# Altium project Zynq7000 SOM.PrjPcb (part 1 of 2)
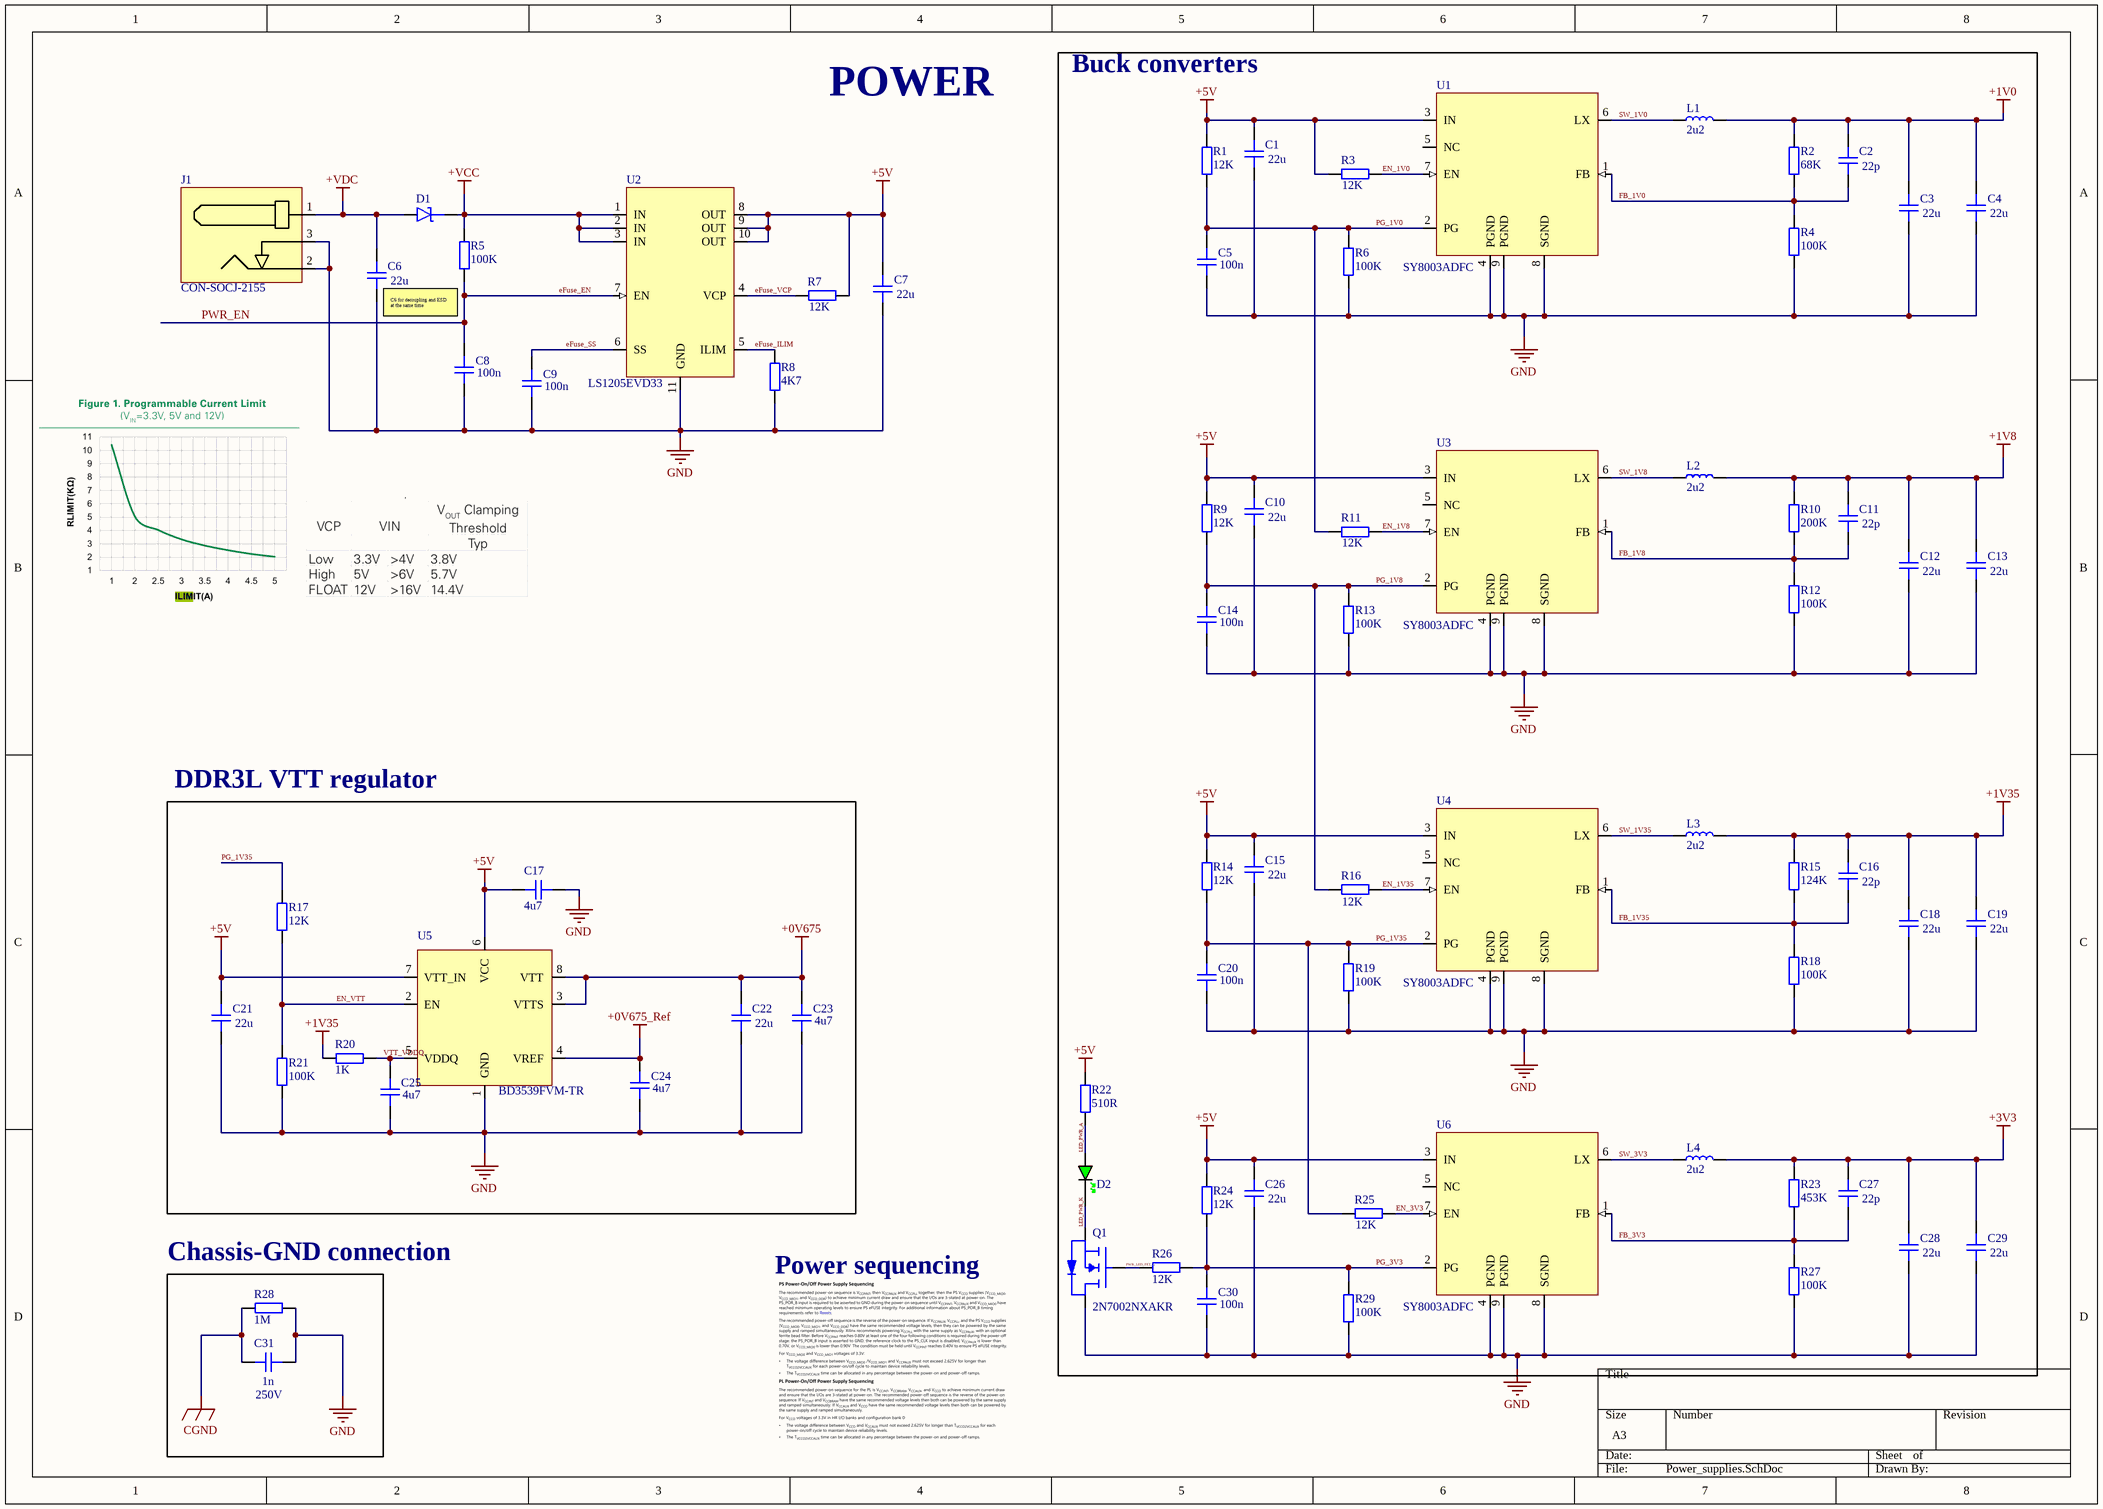
[diagram p0: Power_supplies.SchDoc]
10 sheets, 425 parts. Net scope: global (net labels, ports and power ports of the same name join across sheets).
Board file: Zettbret.PcbDoc
Sheets:
  Power_supplies.SchDoc
  Zynq power and decoupling.SchDoc
  Zynq config, JTAG, Debug.SchDoc
  Zynq processing system (PS).SchDoc
  Zynq programmable logic (PL).SchDoc
  Zynq DDR Interface & Termination.SchDoc
  1GB DDR3L Modules.SchDoc
  Gigabit Ethernet.SchDoc
  USB 2.0 High-Speed (OTG).SchDoc
  Mezzanine Connectors.SchDoc

## Sheet Power_supplies.SchDoc
size A3; SheetNumber: 2; SheetTotal: 11

### Parts
C1  value 22u  [CAP_1210]  (hidden comment: C1210)
C2  value 22p  [CAP_0402]  (hidden comment: C0402)
C3  value 22u  [CAP_1210]  (hidden comment: C1210)
C4  value 22u  [CAP_1210]  (hidden comment: C1210)
C5  value 100n  [CAP_0402]  (hidden comment: C0402)
C6  value 22u  [CAP_1210]  (hidden comment: C1210)
C7  value 22u  [CAP_1210]  (hidden comment: C1210)
C8  value 100n  [CAP_0402]  (hidden comment: C0402)
C9  value 100n  [CAP_0402]  (hidden comment: C0402)
C10  value 22u  [CAP_1210]  (hidden comment: C1210)
C11  value 22p  [CAP_0402]  (hidden comment: C0402)
C12  value 22u  [CAP_1210]  (hidden comment: C1210)
C13  value 22u  [CAP_1210]  (hidden comment: C1210)
C14  value 100n  [CAP_0402]  (hidden comment: C0402)
C15  value 22u  [CAP_1210]  (hidden comment: C1210)
C16  value 22p  [CAP_0402]  (hidden comment: C0402)
C17  value 4u7  [CAP_0402]  (hidden comment: C0402)
C18  value 22u  [CAP_1210]  (hidden comment: C1210)
C19  value 22u  [CAP_1210]  (hidden comment: C1210)
C20  value 100n  [CAP_0402]  (hidden comment: C0402)
C21  value 22u  [CAP_1210]  (hidden comment: C1210)
C22  value 22u  [CAP_1210]  (hidden comment: C1210)
C23  value 4u7  [CAP_0402]  (hidden comment: C0402)
C24  value 4u7  [CAP_0402]  (hidden comment: C0402)
C25  value 4u7  [CAP_0402]  (hidden comment: C0402)
C26  value 22u  [CAP_1210]  (hidden comment: C1210)
C27  value 22p  [CAP_0402]  (hidden comment: C0402)
C28  value 22u  [CAP_1210]  (hidden comment: C1210)
C29  value 22u  [CAP_1210]  (hidden comment: C1210)
C30  value 100n  [CAP_0402]  (hidden comment: C0402)
C31  value 1n  Voltage: 250V  [CAP_1206]  (hidden comment: C1206)
D1  D_SCHOTTKY_SOD_323  [SOD-323]  (value not drawn)
D2  GREEN  [LED_0402_GREEN]  (value not drawn)
J1  CON-SOCJ-2155  [CON-SOCJ-2155]
L1  2u2  [SRP0415]
L2  2u2  [SRP0415]
L3  2u2  [SRP0415]
L4  2u2  [SRP0415]
Q1  2N7002NXAKR  [SSM3J338R,LF-SOT23-F]
R1  value 12K  [RES_0402]  (hidden comment: R0402)
R2  value 68K  [RES_0402]  (hidden comment: R0402)
R3  value 12K  [RES_0402]  (hidden comment: R0402)
R4  value 100K  [RES_0402]  (hidden comment: R0402)
R5  value 100K  [RES_0402]  (hidden comment: R0402)
R6  value 100K  [RES_0402]  (hidden comment: R0402)
R7  value 12K  [RES_0402]  (hidden comment: R0402)
R8  value 4K7  [RES_0402]  (hidden comment: R0402)
R9  value 12K  [RES_0402]  (hidden comment: R0402)
R10  value 200K  [RES_0402]  (hidden comment: R0402)
R11  value 12K  [RES_0402]  (hidden comment: R0402)
R12  value 100K  [RES_0402]  (hidden comment: R0402)
R13  value 100K  [RES_0402]  (hidden comment: R0402)
R14  value 12K  [RES_0402]  (hidden comment: R0402)
R15  value 124K  [RES_0402]  (hidden comment: R0402)
R16  value 12K  [RES_0402]  (hidden comment: R0402)
R17  value 12K  [RES_0402]  (hidden comment: R0402)
R18  value 100K  [RES_0402]  (hidden comment: R0402)
R19  value 100K  [RES_0402]  (hidden comment: R0402)
R20  value 1K  [RES_0402]  (hidden comment: R0402)
R21  value 100K  [RES_0402]  (hidden comment: R0402)
R22  value 510R  [RES_0402]  (hidden comment: R0402)
R23  value 453K  [RES_0402]  (hidden comment: R0402)
R24  value 12K  [RES_0402]  (hidden comment: R0402)
R25  value 12K  [RES_0402]  (hidden comment: R0402)
R26  value 12K  [RES_0402]  (hidden comment: R0402)
R27  value 100K  [RES_0402]  (hidden comment: R0402)
R28  1M  [RES_1206]
R29  value 100K  [RES_0402]  (hidden comment: R0402)
U1  SY8003ADFC  [DFN2x2-8]
U2  LS1205EVD33  [DFN3x3_10L]
U3  SY8003ADFC  [DFN2x2-8]
U4  SY8003ADFC  [DFN2x2-8]
U5  BD3539FVM-TR  [MSOP8]
U6  SY8003ADFC  [DFN2x2-8]

### Blocks framed on the sheet
Buck converters: C1-C5 C10-C16 C18-C20 C26-C30 D2 L1-L4 Q1 R1-R4 R6 R9-R16 R18 R19 R22-R27 R29 U1 U3 U4 U6
DDR3L VTT regulator: C17 C21-C25 R17 R20 R21 U5
Chassis-GND connection: C31 R28

### Nets
+0V675: C22.2 C23.2 U5.3(VTTS) U5.8(VTT)
+0V675_Ref: C24.2 U5.4(VREF)
+1V0: C2.2 C3.2 C4.2 L1.2 R2.2
+1V8: C11.2 C12.2 C13.2 L2.2 R10.2
+1V35: C16.2 C18.2 C19.2 L3.2 R15.2 R20.2
+3V3: C27.2 C28.2 C29.2 L4.2 R23.2
+5V: C1.2 C7.2 C10.2 C15.2 C17.2 C21.2 C26.2 R1.2 R3.1 R7.2 R9.2 R14.2 R22.2 R24.2 U1.3(IN) U2.8(OUT) U2.9(OUT) U2.10(OUT) U3.3(IN) U4.3(IN) U5.6(VCC) U5.7(VTT_IN) U6.3(IN)
+VCC: D1.K R5.2 U2.1(IN) U2.2(IN) U2.3(IN)
+VDC: C6.2 D1.A J1.1
CGND: C31.1 R28.1
GND: C1.1 C3.1 C4.1 C5.1 C6.1 C7.1 C8.1 C9.1 C10.1 C12.1 C13.1 C14.1 C15.1 C17.1 C18.1 C19.1 C20.1 C21.1 C22.1 C23.1 C24.1 C25.1 C26.1 C28.1 C29.1 C30.1 C31.2 J1.2 J1.3 Q1.D R4.1 R6.1 R8.1 R12.1 R13.1 R18.1 R19.1 R21.1 R27.1 R28.2 R29.1 U1.4(PGND) U1.8(SGND) U1.9(PGND) U2.11(GND) U3.4(PGND) U3.8(SGND) U3.9(PGND) U4.4(PGND) U4.8(SGND) U4.9(PGND) U5.1(GND) U6.4(PGND) U6.8(SGND) U6.9(PGND)
eFuse_EN: C8.2 R5.1 U2.7(EN)  [also labelled PWR_EN]
eFuse_ILIM: R8.2 U2.5(ILIM)
eFuse_SS: C9.2 U2.6(SS)
eFuse_VCP: R7.1 U2.4(VCP)
EN_1V0: R3.2 U1.7(EN)
EN_1V8: R11.2 U3.7(EN)
EN_1V35: R16.2 U4.7(EN)
EN_3V3: R25.2 U6.7(EN)
EN_VTT: R17.1 R21.2 U5.2(EN)
FB_1V0: C2.1 R2.1 R4.2 U1.1(FB)
FB_1V8: C11.1 R10.1 R12.2 U3.1(FB)
FB_1V35: C16.1 R15.1 R18.2 U4.1(FB)
FB_3V3: C27.1 R23.1 R27.2 U6.1(FB)
LED_PWR_A: D2.A R22.1
LED_PWR_K: D2.K Q1.S
PG_1V0: C5.2 R1.1 R6.2 R11.1 U1.2(PG)
PG_1V8: C14.2 R9.1 R13.2 R16.1 U3.2(PG)
PG_1V35: C20.2 R14.1 R17.2 R19.2 R25.1 U4.2(PG)
PG_3V3: C30.2 R24.1 R26.1 R29.2 U6.2(PG)
PWR_LED_FET_G: Q1.G R26.2
SW_1V0: L1.1 U1.6(LX)
SW_1V8: L2.1 U3.6(LX)
SW_1V35: L3.1 U4.6(LX)
SW_3V3: L4.1 U6.6(LX)
VTT_VDDQ: C25.2 R20.1 U5.5(VDDQ)

Not connected (* = marked no-connect by the designer): U1 5(NC); U3 5(NC); U4 5(NC); U6 5(NC)

### Notes on the sheet
- POWER
- (near C6) C6 for decoupling and ESD at the same time
- Power sequencing

### Library data of the parts
C1 C3 C4 C6 C7 C10 C12 C13 C15 C18 C19 C21 C22 C26 C28 C29 = CAP_1210: Capacitor SMD 1210; Manufacturer: *; Manufacturer Part Number: *; Distributor Link: *; LCSC: *; Rating: *; Dielectric: *
C2 C5 C8 C9 C11 C14 C16 C17 C20 C23-C25 C27 C30 = CAP_0402: Capacitor SMD 0402; Manufacturer: *; Manufacturer Part Number: *; Distributor Link: *; LCSC: *; Rating: *; Dielectric: *
C31 = CAP_1206: Capacitor SMD 1206; Manufacturer: *; Manufacturer Part Number: *; Distributor Link: *; LCSC: *; Rating: *; Dielectric: *
D1 = D_SCHOTTKY_SOD_323: Diode Schottky SMD SOD-323
D2 = LED_0402_GREEN: LED 0402 GREEN SMD
J1 = CON-SOCJ-2155: DC Barrell Jack 2.1mm 30V 2.5A THT; Manufacturer: Gravitech; Manufacturer Part Number: CON-SOCJ-2155
L1-L4 = SRP0415-2R2K: Inductor SMD 2.2uH Bourns SRP0415-2R2K; Manufacturer: Bourns; Manufacturer Part Number: SRP0415-2R2K
Q1 = 2N7002NXAKR: MOSFET N-Channel Vds=60V Id=300mA with ESD Protection; Manufacturer: Nexperia; Manufacturer Part Number: 2N7002NXAKR
R1-R27 R29 = RES_0402: Resistor SMD 0402; Manufacturer: *; Manufacturer Part Number: *; Distributor Link: *; LCSC: *
R28 = RES_1206: Resistor SMD 1206; Manufacturer: *; Manufacturer Part Number: *; Distributor Link: *; LCSC: *
U1 U3 U4 U6 = SY8003ADFC: High Efficiency 5.5V, 3A Continuous, 1MHz Synchronous Step Down Regulator; Manufacturer: Silergy; Manufacturer Part Number: High Efficiency 5.5V, 3A continuous, 1MHz; LCSC: C178236
U2 = LS1205EVD33: 18V, 5A eFuse with Programmable Current Limit and Output Voltage Clamp; Manufacturer: Littelfuse; Manufacturer Part Number: LS1205EVD33
U5 = BD3539FVM-TR: 1.0V to 5.5V, 1A 1Ch Termination Regulator for DDR-SDRAMs; Manufacturer: ROHM Semiconductor; Manufacturer Part Number: BD3539FVM-TR

## Sheet Zynq power and decoupling.SchDoc
size A3; SheetNumber: 3; SheetTotal: 11
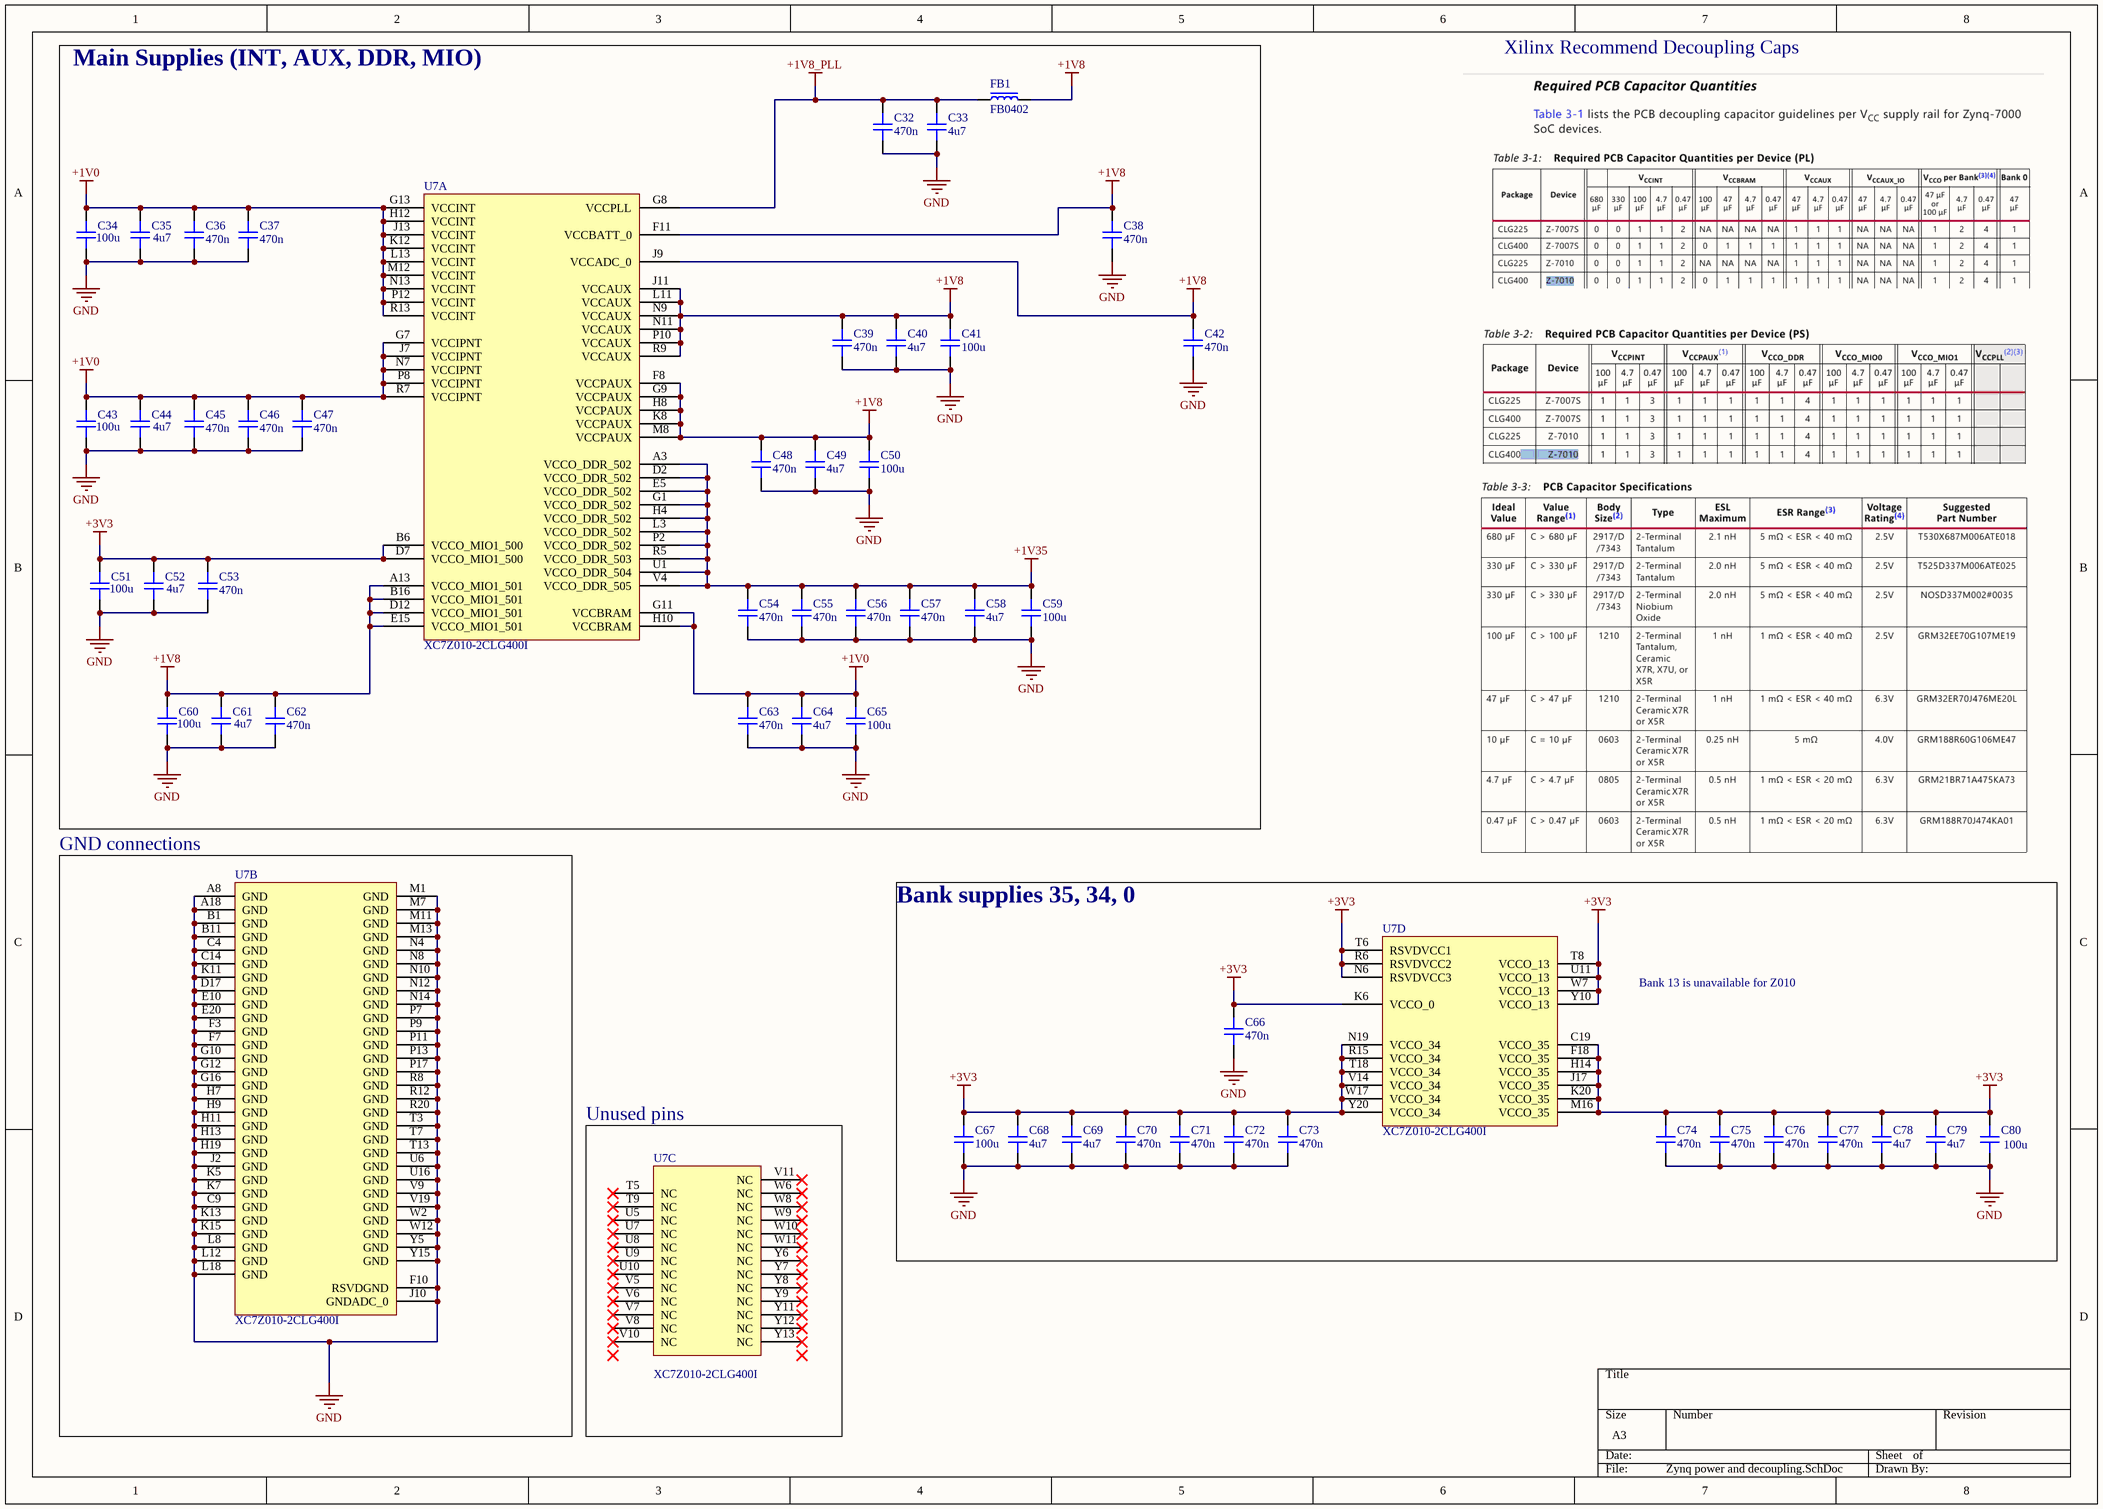
[diagram p1: Zynq power and decoupling.SchDoc]

### Parts
C32  value 470n  [CAP_0201]  (hidden comment: C0201)
C33  value 4u7  [CAP_0402]  (hidden comment: C0402)
C34  value 100u  [CAP_1210]  (hidden comment: C1210)
C35  value 4u7  [CAP_0402]  (hidden comment: C0402)
C36  value 470n  [CAP_0201]  (hidden comment: C0201)
C37  value 470n  [CAP_0201]  (hidden comment: C0201)
C38  value 470n  [CAP_0201]  (hidden comment: C0201)
C39  value 470n  [CAP_0201]  (hidden comment: C0201)
C40  value 4u7  [CAP_0402]  (hidden comment: C0402)
C41  value 100u  [CAP_1210]  (hidden comment: C1210)
C42  value 470n  [CAP_0201]  (hidden comment: C0201)
C43  value 100u  [CAP_1210]  (hidden comment: C1210)
C44  value 4u7  [CAP_0402]  (hidden comment: C0402)
C45  value 470n  [CAP_0201]  (hidden comment: C0201)
C46  value 470n  [CAP_0201]  (hidden comment: C0201)
C47  value 470n  [CAP_0201]  (hidden comment: C0201)
C48  value 470n  [CAP_0201]  (hidden comment: C0201)
C49  value 4u7  [CAP_0402]  (hidden comment: C0402)
C50  value 100u  [CAP_1210]  (hidden comment: C1210)
C51  value 100u  [CAP_1210]  (hidden comment: C1210)
C52  value 4u7  [CAP_0402]  (hidden comment: C0402)
C53  value 470n  [CAP_0201]  (hidden comment: C0201)
C54  value 470n  [CAP_0201]  (hidden comment: C0201)
C55  value 470n  [CAP_0201]  (hidden comment: C0201)
C56  value 470n  [CAP_0201]  (hidden comment: C0201)
C57  value 470n  [CAP_0201]  (hidden comment: C0201)
C58  value 4u7  [CAP_0402]  (hidden comment: C0402)
C59  value 100u  [CAP_1210]  (hidden comment: C1210)
C60  value 100u  [CAP_1210]  (hidden comment: C1210)
C61  value 4u7  [CAP_0402]  (hidden comment: C0402)
C62  value 470n  [CAP_0201]  (hidden comment: C0201)
C63  value 470n  [CAP_0201]  (hidden comment: C0201)
C64  value 4u7  [CAP_0402]  (hidden comment: C0402)
C65  value 100u  [CAP_1210]  (hidden comment: C1210)
C66  value 470n  [CAP_0201]  (hidden comment: C0201)
C67  value 100u  [CAP_1210]  (hidden comment: C1210)
C68  value 4u7  [CAP_0402]  (hidden comment: C0402)
C69  value 4u7  [CAP_0402]  (hidden comment: C0402)
C70  value 470n  [CAP_0201]  (hidden comment: C0201)
C71  value 470n  [CAP_0201]  (hidden comment: C0201)
C72  value 470n  [CAP_0201]  (hidden comment: C0201)
C73  value 470n  [CAP_0201]  (hidden comment: C0201)
C74  value 470n  [CAP_0201]  (hidden comment: C0201)
C75  value 470n  [CAP_0201]  (hidden comment: C0201)
C76  value 470n  [CAP_0201]  (hidden comment: C0201)
C77  value 470n  [CAP_0201]  (hidden comment: C0201)
C78  value 4u7  [CAP_0402]  (hidden comment: C0402)
C79  value 4u7  [CAP_0402]  (hidden comment: C0402)
C80  value 100u  [CAP_1210]  (hidden comment: C1210)
FB1  FB0402  [FB_0402]
U7  XC7Z010-2CLG400I  [BGA400C80P20X20_1700X1700X160N]  (parts A,B,C,D of 9)

### Blocks framed on the sheet
Main Supplies (INT, AUX, DDR, MIO): C32-C65 FB1 U7
GND connections: U7
Bank supplies 35, 34, 0: C66-C80 U7
Unused pins: U7

### Nets
+1V0: C34.2 C35.2 C36.2 C37.2 C43.2 C44.2 C45.2 C46.2 C47.2 C63.2 C64.2 C65.2 U7.G7(VCCIPNT) U7.G11(VCCBRAM) U7.G13(VCCINT) U7.H10(VCCBRAM) U7.H12(VCCINT) U7.J7(VCCIPNT) U7.J13(VCCINT) U7.K12(VCCINT) U7.L13(VCCINT) U7.M12(VCCINT) U7.N7(VCCIPNT) U7.N13(VCCINT) U7.P8(VCCIPNT) U7.P12(VCCINT) U7.R7(VCCIPNT) U7.R13(VCCINT)
+1V8: C38.2 C39.2 C40.2 C41.2 C42.2 C48.2 C49.2 C50.2 C60.2 C61.2 C62.2 FB1.2 U7.A13(VCCO_MIO1_501) U7.B16(VCCO_MIO1_501) U7.D12(VCCO_MIO1_501) U7.E15(VCCO_MIO1_501) U7.F8(VCCPAUX) U7.F11(VCCBATT_0) U7.G9(VCCPAUX) U7.H8(VCCPAUX) U7.J9(VCCADC_0) U7.J11(VCCAUX) U7.K8(VCCPAUX) U7.L11(VCCAUX) U7.M8(VCCPAUX) U7.N9(VCCAUX) U7.N11(VCCAUX) U7.P10(VCCAUX) U7.R9(VCCAUX)
+1V8_PLL: C32.2 C33.2 FB1.1 U7.G8(VCCPLL)
+1V35: C54.2 C55.2 C56.2 C57.2 C58.2 C59.2 U7.A3(VCCO_DDR_502) U7.D2(VCCO_DDR_502) U7.E5(VCCO_DDR_502) U7.G1(VCCO_DDR_502) U7.H4(VCCO_DDR_502) U7.L3(VCCO_DDR_502) U7.P2(VCCO_DDR_502) U7.R5(VCCO_DDR_503) U7.U1(VCCO_DDR_504) U7.V4(VCCO_DDR_505)
+3V3: C51.2 C52.2 C53.2 C66.2 C67.2 C68.2 C69.2 C70.2 C71.2 C72.2 C73.2 C74.2 C75.2 C76.2 C77.2 C78.2 C79.2 C80.2 U7.B6(VCCO_MIO1_500) U7.C19(VCCO_35) U7.D7(VCCO_MIO1_500) U7.F18(VCCO_35) U7.H14(VCCO_35) U7.J17(VCCO_35) U7.K6(VCCO_0) U7.K20(VCCO_35) U7.M16(VCCO_35) U7.N6(RSVDVCC3) U7.N19(VCCO_34) U7.R6(RSVDVCC2) U7.R15(VCCO_34) U7.T6(RSVDVCC1) U7.T8(VCCO_13) U7.T18(VCCO_34) U7.U11(VCCO_13) U7.V14(VCCO_34) U7.W7(VCCO_13) U7.W17(VCCO_34) U7.Y10(VCCO_13) U7.Y20(VCCO_34)
GND: C32.1 C33.1 C34.1 C35.1 C36.1 C37.1 C38.1 C39.1 C40.1 C41.1 C42.1 C43.1 C44.1 C45.1 C46.1 C47.1 C48.1 C49.1 C50.1 C51.1 C52.1 C53.1 C54.1 C55.1 C56.1 C57.1 C58.1 C59.1 C60.1 C61.1 C62.1 C63.1 C64.1 C65.1 C66.1 C67.1 C68.1 C69.1 C70.1 C71.1 C72.1 C73.1 C74.1 C75.1 C76.1 C77.1 C78.1 C79.1 C80.1 U7.A8(GND) U7.A18(GND) U7.B1(GND) U7.B11(GND) U7.C4(GND) U7.C9(GND) U7.C14(GND) U7.D17(GND) U7.E10(GND) U7.E20(GND) U7.F3(GND) U7.F7(GND) U7.F10(RSVDGND) U7.G10(GND) U7.G12(GND) U7.G16(GND) U7.H7(GND) U7.H9(GND) U7.H11(GND) U7.H13(GND) U7.H19(GND) U7.J2(GND) U7.J10(GNDADC_0) U7.K5(GND) U7.K7(GND) U7.K11(GND) U7.K13(GND) U7.K15(GND) U7.L8(GND) U7.L12(GND) U7.L18(GND) U7.M1(GND) U7.M7(GND) U7.M11(GND) U7.M13(GND) U7.N4(GND) U7.N8(GND) U7.N10(GND) U7.N12(GND) U7.N14(GND) U7.P7(GND) U7.P9(GND) U7.P11(GND) U7.P13(GND) U7.P17(GND) U7.R8(GND) U7.R12(GND) U7.R20(GND) U7.T3(GND) U7.T7(GND) U7.T13(GND) U7.U6(GND) U7.U16(GND) U7.V9(GND) U7.V19(GND) U7.W2(GND) U7.W12(GND) U7.Y5(GND) U7.Y15(GND)

Not connected (* = marked no-connect by the designer): U7 T5(NC)* T9(NC)* U5(NC)* U7(NC)* U8(NC)* U9(NC)* U10(NC)* V5(NC)* V6(NC)* V7(NC)* V8(NC)* V10(NC)* V11(NC)* W6(NC)* W8(NC)* W9(NC)* W10(NC)* W11(NC)* Y6(NC)* Y7(NC)* Y8(NC)* Y9(NC)* Y11(NC)* Y12(NC)* Y13(NC)*

### Notes on the sheet
- Xilinx Recommend Decoupling Caps
- Bank 13 is unavailable for Z010

### Library data of the parts
C32 C36-C39 C42 C45-C48 C53-C57 C62 C63 C66 C70-C77 = CAP_0201: Capacitor SMD 0201; Rating: 16V; Manufacturer: *; Manufacturer Part Number: *; Distributor Link: *; LCSC: *; Dielectric: *
C33 C35 C40 C44 C49 C52 C58 C61 C64 C68 C69 C78 C79 = CAP_0402: Capacitor SMD 0402; Manufacturer: *; Manufacturer Part Number: *; Distributor Link: *; LCSC: *; Rating: *; Dielectric: *
C34 C41 C43 C50 C51 C59 C60 C65 C67 C80 = CAP_1210: Capacitor SMD 1210; Manufacturer: *; Manufacturer Part Number: *; Distributor Link: *; LCSC: *; Rating: *; Dielectric: *
FB1 = FB_0402: Ferrite Bead SMD 0402; Manufacturer: *; Manufacturer Part Number: *; Distributor Link: *; LCSC: *

## Sheet Zynq config, JTAG, Debug.SchDoc
size A2; SheetNumber: 4; SheetTotal: 11
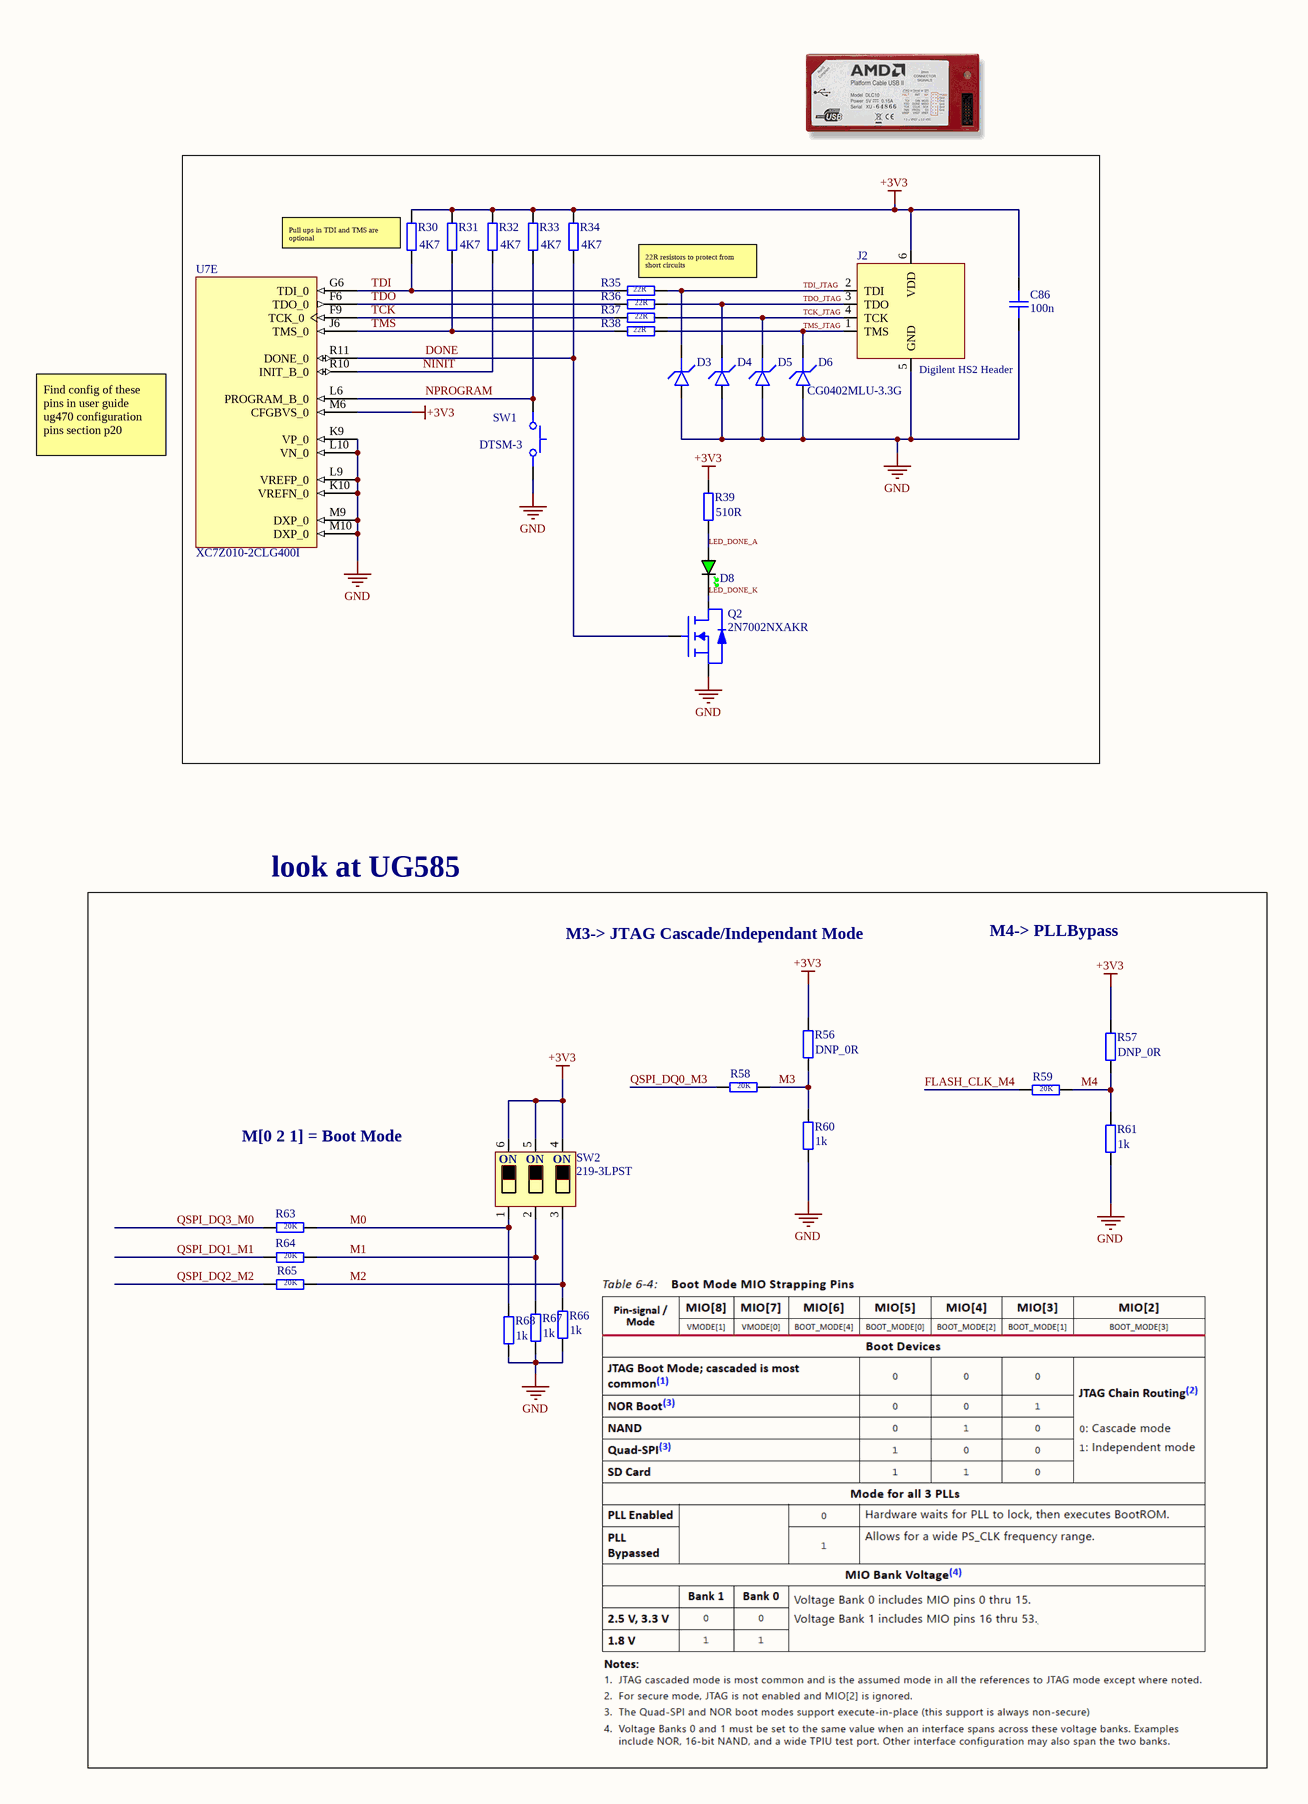
[diagram p2: Zynq config, JTAG, Debug.SchDoc, left]
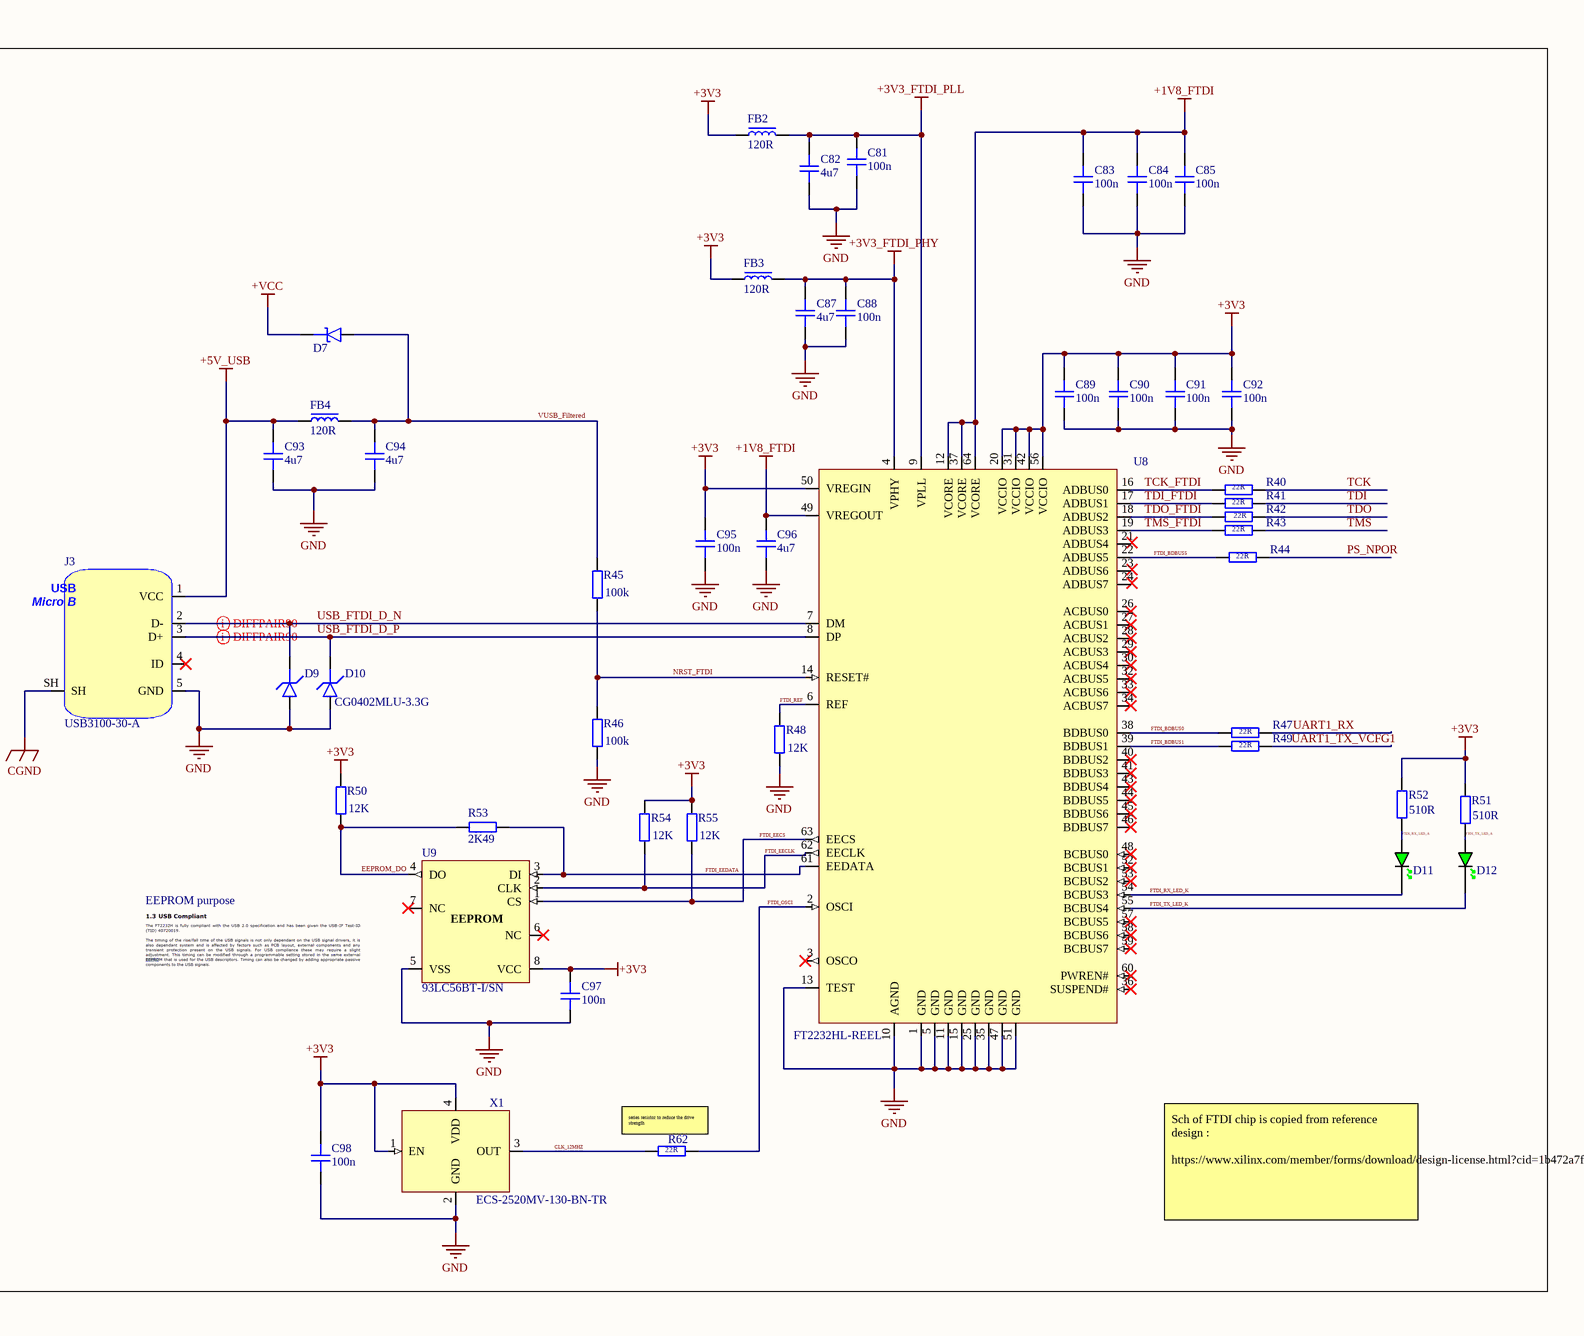
[diagram p3: Zynq config, JTAG, Debug.SchDoc, right]

### Parts
C81  100n  [CAP_0402]
C82  4u7  [CAP_0402]
C83  100n  [CAP_0402]
C84  100n  [CAP_0402]
C85  100n  [CAP_0402]
C86  100n  [CAP_0402]
C87  4u7  [CAP_0402]
C88  100n  [CAP_0402]
C89  100n  [CAP_0402]
C90  100n  [CAP_0402]
C91  100n  [CAP_0402]
C92  100n  [CAP_0402]
C93  4u7  [CAP_0402]
C94  4u7  [CAP_0402]
C95  100n  [CAP_0402]
C96  4u7  [CAP_0402]
C97  100n  [CAP_0402]
C98  100n  [CAP_0402]
D3  D_TVS_0402  [D_0402]  (value not drawn)
D4  D_TVS_0402  [D_0402]  (value not drawn)
D5  D_TVS_0402  [D_0402]  (value not drawn)
D6  Designator: CG0402MLU-3.3G  [D_0402]  (hidden comment: D_TVS_0402)
D7  D_SCHOTTKY_SOD_323  [SOD-323]  (value not drawn)
D8  GREEN  [LED_0402_GREEN]  (value not drawn)
D9  D_TVS_0402  [D_0402]  (value not drawn)
D10  Designator: CG0402MLU-3.3G  [D_0402]  (hidden comment: D_TVS_0402)
D11  GREEN  [LED_0402_GREEN]  (value not drawn)
D12  GREEN  [LED_0402_GREEN]  (value not drawn)
FB2  120R  [FB_0402]
FB3  120R  [FB_0402]
FB4  120R  [FB_0402]
J2  Digilent HS2 Header  [DIGILENT_HS2]
J3  USB3100-30-A  [USB3100-30-A]
Q2  2N7002NXAKR  [SSM3J338R,LF-SOT23-F]
R30  value 4K7  [RES_0402]  (hidden comment: R0402)
R31  value 4K7  [RES_0402]  (hidden comment: R0402)
R32  value 4K7  [RES_0402]  (hidden comment: R0402)
R33  value 4K7  [RES_0402]  (hidden comment: R0402)
R34  value 4K7  [RES_0402]  (hidden comment: R0402)
R35  value 22R  [RES_0402]  (hidden comment: R0402)
R36  value 22R  [RES_0402]  (hidden comment: R0402)
R37  value 22R  [RES_0402]  (hidden comment: R0402)
R38  value 22R  [RES_0402]  (hidden comment: R0402)
R39  value 510R  [RES_0402]  (hidden comment: R0402)
R40  value 22R  [RES_0402]  (hidden comment: R0402)
R41  value 22R  [RES_0402]  (hidden comment: R0402)
R42  value 22R  [RES_0402]  (hidden comment: R0402)
R43  value 22R  [RES_0402]  (hidden comment: R0402)
R44  value 22R  [RES_0402]  (hidden comment: R0402)
R45  value 100k  [RES_0402]  (hidden comment: R0402)
R46  value 100k  [RES_0402]  (hidden comment: R0402)
R47  value 22R  [RES_0402]  (hidden comment: R0402)
R48  value 12K  [RES_0402]  (hidden comment: R0402)
R49  value 22R  [RES_0402]  (hidden comment: R0402)
R50  value 12K  [RES_0402]  (hidden comment: R0402)
R51  value 510R  [RES_0402]  (hidden comment: R0402)
R52  value 510R  [RES_0402]  (hidden comment: R0402)
R53  value 2K49  [RES_0402]  (hidden comment: R0402)
R54  value 12K  [RES_0402]  (hidden comment: R0402)
R55  value 12K  [RES_0402]  (hidden comment: R0402)
R56  value DNP_0R  [RES_0402]  (hidden comment: R0402)
R57  value DNP_0R  [RES_0402]  (hidden comment: R0402)
R58  value 20K  [RES_0402]  (hidden comment: R0402)
R59  value 20K  [RES_0402]  (hidden comment: R0402)
R60  value 1k  [RES_0402]  (hidden comment: R0402)
R61  value 1k  [RES_0402]  (hidden comment: R0402)
R62  value 22R  [RES_0402]  (hidden comment: R0402)
R63  value 20K  [RES_0402]  (hidden comment: R0402)
R64  value 20K  [RES_0402]  (hidden comment: R0402)
R65  value 20K  [RES_0402]  (hidden comment: R0402)
R66  value 1k  [RES_0402]  (hidden comment: R0402)
R67  value 1k  [RES_0402]  (hidden comment: R0402)
R68  value 1k  [RES_0402]  (hidden comment: R0402)
SW1  DTSM-3  [DTSM-3]
SW2  219-3LPST  [219-3LPST]
U7  XC7Z010-2CLG400I  [BGA400C80P20X20_1700X1700X160N]  (part E of 9)
U8  FT2232HL-REEL  [LQFP-64-0.5mm]
U9  93LC56BT-I/SN  [SOIC-8]
X1  ECS-2520MV-130-BN-TR  [XTAL_2520]

### Blocks framed on the sheet
look at UG585: R56-R61 R63-R68 SW2

### Nets
+1V8_FTDI: C83.2 C84.2 C85.2 C96.2 U8.12(VCORE) U8.37(VCORE) U8.49(VREGOUT) U8.64(VCORE)
+3V3: C86.2 C89.2 C90.2 C91.2 C92.2 C95.2 C97.2 C98.2 FB2.1 FB3.1 J2.6(VDD) R30.2 R31.2 R32.2 R33.2 R34.2 R39.1 R50.2 R51.1 R52.1 R54.2 R55.2 R56.1 R57.1 SW2.4 SW2.5 SW2.6 U7.M6(CFGBVS_0) U8.20(VCCIO) U8.31(VCCIO) U8.42(VCCIO) U8.50(VREGIN) U8.56(VCCIO) U9.8(VCC) X1.1(EN) X1.4(VDD)
+3V3_FTDI_PHY: C87.2 C88.2 FB3.2 U8.4(VPHY)
+3V3_FTDI_PLL: C81.2 C82.2 FB2.2 U8.9(VPLL)
+5V_USB: C93.2 FB4.1 J3.1(VCC)
+VCC: D7.K
CGND: J3.SH
GND: C81.1 C82.1 C83.1 C84.1 C85.1 C86.1 C87.1 C88.1 C89.1 C90.1 C91.1 C92.1 C93.1 C94.1 C95.1 C96.1 C97.1 C98.1 D3.A D4.A D5.A D6.A D9.A D10.A J2.5(GND) J3.5(GND) Q2.S R46.1 R48.1 R60.2 R61.2 R66.2 R67.2 R68.2 SW1.2 U7.K9(VP_0) U7.K10(VREFN_0) U7.L9(VREFP_0) U7.L10(VN_0) U7.M9(DXP_0) U7.M10(DXP_0) U8.1(GND) U8.5(GND) U8.10(AGND) U8.11(GND) U8.13(TEST) U8.15(GND) U8.25(GND) U8.35(GND) U8.47(GND) U8.51(GND) U9.5(VSS) X1.2(GND)
CLK_12MHZ: R62.1 X1.3(OUT)
DONE: Q2.G R34.1 U7.R11(DONE_0)
EEPROM_DO: R50.1 R53.2 U9.4(DO)
FLASH_CLK_M4: R59.1
FTDI_BDBUS0: R47.1 U8.38(BDBUS0)
FTDI_BDBUS1: R49.1 U8.39(BDBUS1)
FTDI_BDBUS5: R44.1 U8.22(ADBUS5)
FTDI_EECLK: R54.1 U8.62(EECLK) U9.2(CLK)
FTDI_EECS: R55.1 U8.63(EECS) U9.1(CS)
FTDI_EEDATA: R53.1 U8.61(EEDATA) U9.3(DI)
FTDI_OSCI: R62.2 U8.2(OSCI)
FTDI_REF: R48.2 U8.6(REF)
FTDI_RX_LED_A: D11.A R52.2
FTDI_RX_LED_K: D11.K U8.54(BCBUS3)
FTDI_TX_LED_A: D12.A R51.2
FTDI_TX_LED_K: D12.K U8.55(BCBUS4)
LED_DONE_A: D8.A R39.2
LED_DONE_K: D8.K Q2.D
M0: R63.2 R68.1 SW2.1
M1: R64.2 R67.1 SW2.2
M2: R65.2 R66.1 SW2.3
M3: R56.2 R58.2 R60.1
M4: R57.2 R59.2 R61.1
NINIT: R32.1 U7.R10(INIT_B_0)
NPROGRAM: R33.1 SW1.1 U7.L6(PROGRAM_B_0)
NRST_FTDI: R45.1 R46.2 U8.14(RESET#)
PS_NPOR: R44.2
QSPI_DQ0_M3: R58.1
QSPI_DQ1_M1: R64.1
QSPI_DQ2_M2: R65.1
QSPI_DQ3_M0: R63.1
TCK: R37.2 R40.2 U7.F9(TCK_0)
TCK_FTDI: R40.1 U8.16(ADBUS0)
TCK_JTAG: D5.K J2.4(TCK) R37.1
TDI: R30.1 R35.2 R41.2 U7.G6(TDI_0)
TDI_FTDI: R41.1 U8.17(ADBUS1)
TDI_JTAG: D3.K J2.2(TDI) R35.1
TDO: R36.2 R42.2 U7.F6(TDO_0)
TDO_FTDI: R42.1 U8.18(ADBUS2)
TDO_JTAG: D4.K J2.3(TDO) R36.1
TMS: R31.1 R38.2 R43.2 U7.J6(TMS_0)
TMS_FTDI: R43.1 U8.19(ADBUS3)
TMS_JTAG: D6.K J2.1(TMS) R38.1
UART1_RX: R47.2
UART1_TX_VCFG1: R49.2
USB_FTDI_D_N: D9.K J3.2(D-) U8.7(DM)
USB_FTDI_D_P: D10.K J3.3(D+) U8.8(DP)
VUSB_Filtered: C94.2 D7.A FB4.2 R45.2

Not connected (* = marked no-connect by the designer): J3 4(ID)*; U8 3(OSCO)* 21(ADBUS4) 23(ADBUS6) 24(ADBUS7) 26(ACBUS0)* 27(ACBUS1)* 28(ACBUS2)* 29(ACBUS3)* 30(ACBUS4)* 32(ACBUS5)* 33(ACBUS6)* 34(ACBUS7)* 36(SUSPEND#)* 40(BDBUS2)* 41(BDBUS3)* 43(BDBUS4)* 44(BDBUS5)* 45(BDBUS6)* 46(BDBUS7)* 48(BCBUS0)* 52(BCBUS1)* 53(BCBUS2)* 57(BCBUS5)* 58(BCBUS6)* 59(BCBUS7)* 60(PWREN#)*; U9 6(NC)* 7(NC)*

### Layout directives
differential pair; differential pair class 90OHM: USB_FTDI_D_N, USB_FTDI_D_P

### Notes on the sheet
- (near R30) Pull ups in TDI and TMS are optional
- (near R35) 22R resistors to protect from short circuits
- Find config of these pins in user guide ug470 configuration pins section p20
- M3-> JTAG Cascade/Independant Mode
- M4-> PLLBypass
- EEPROM purpose
- (near U9) EEPROM
- M[0 2 1] = Boot Mode
- (near R62) series resistor to reduce the drive strength
- Sch of FTDI chip is copied from reference design :
  https://www.xilinx.com/member/forms/download/design-license.html?cid=1b472a7f-089f-495e-97cb-68bcb4cceec8&filename=vck190-schematic-xtp610.zip
- (in symbol 219-3LPST) ON
- (in symbol USB3100-30-A) USB; Micro B

### Library data of the parts
C81-C98 = CAP_0402: Capacitor SMD 0402; Manufacturer: *; Manufacturer Part Number: *; Distributor Link: *; LCSC: *; Rating: *; Dielectric: *
  C81-C85 C87-C98: package: 0402
D3-D5 D9 = D_TVS_0402: Diode TVS / ESD 0402; Designator: CG0402MLU-3.3G
D6 D10 = D_TVS_0402: Diode TVS / ESD 0402
D7 = D_SCHOTTKY_SOD_323: Diode Schottky SMD SOD-323
D8 D11 D12 = LED_0402_GREEN: LED 0402 GREEN SMD
FB2-FB4 = FB_0402: Ferrite Bead SMD 0402; Manufacturer: *; Manufacturer Part Number: *; Distributor Link: *; LCSC: *
J2 = Digilent_HS2_Header: Digilent HS2 6-Pin 2.54mm Pitch Header; Manufacturer: Amphenol FCI; Manufacturer Part Number: 68000-406HLF
J3 = USB3100-30-A: USB Connector Type Micro B 2.0 SMD Reverse Mount; Manufacturer: GCT; Manufacturer Part Number: USB3100-30-A
Q2 = 2N7002NXAKR: as Q1 on sheet Power_supplies; Manufacturer Part Number: 2N7002NXAKR
R30-R68 = RES_0402: Resistor SMD 0402; Manufacturer: *; Manufacturer Part Number: *; Distributor Link: *; LCSC: *
SW1 = DTSM-3: Tactile Switch SMD SPST; Manufacturer: Diptronics; Manufacturer Part Number: DTSM-3
SW2 = 219-3LPST: DIP Switches SPST 3x; Manufacturer: CTS; Manufacturer Part Number: 219-3LPST
U8 = FT2232HL-REEL: Hi-Speed Dual USB UART/FIFO IC; Manufacturer: FTDI; Manufacturer Part Number: FT2232HL-REEL; Distributor Link: https://www.mouser.de/ProductDetail/FTDI/FT2232HL-REEL?qs=D1%2FPMqvA100v7FHcEx164g%3D%3D; LCSC: C27882
U9 = 93LC56BT-I/SN: 2K Microwire Compatible Serial EEPROM; Manufacturer: Microchip; Manufacturer Part Number: 93LC56BT-I/SN; Distributor Link: https://www.mouser.de/ProductDetail/Microchip-Technology/93LC56BT-I-SN?qs=lQv0JY93vreW%252BBssv4v8RA%3D%3D; LCSC: C6164
X1 = ECS-2520MV-130-BN-TR: Standard Clock Oscillators XO (Standard),13MHz,Standby (Power Down),CMOS, Multi-Volt,1.6 V 3.6 V,+/-50ppm,-40 C 85 C,6mA,Surface Mount,4-SMD, No Lead,(2.50mm x 2.00mm),(0.80mm); Manufacturer: ECS; Manufacturer Part Number: ECS-2520MV-130-BN-TR

## Sheet Zynq processing system (PS).SchDoc
size A2; SheetNumber: 5; SheetTotal: 11
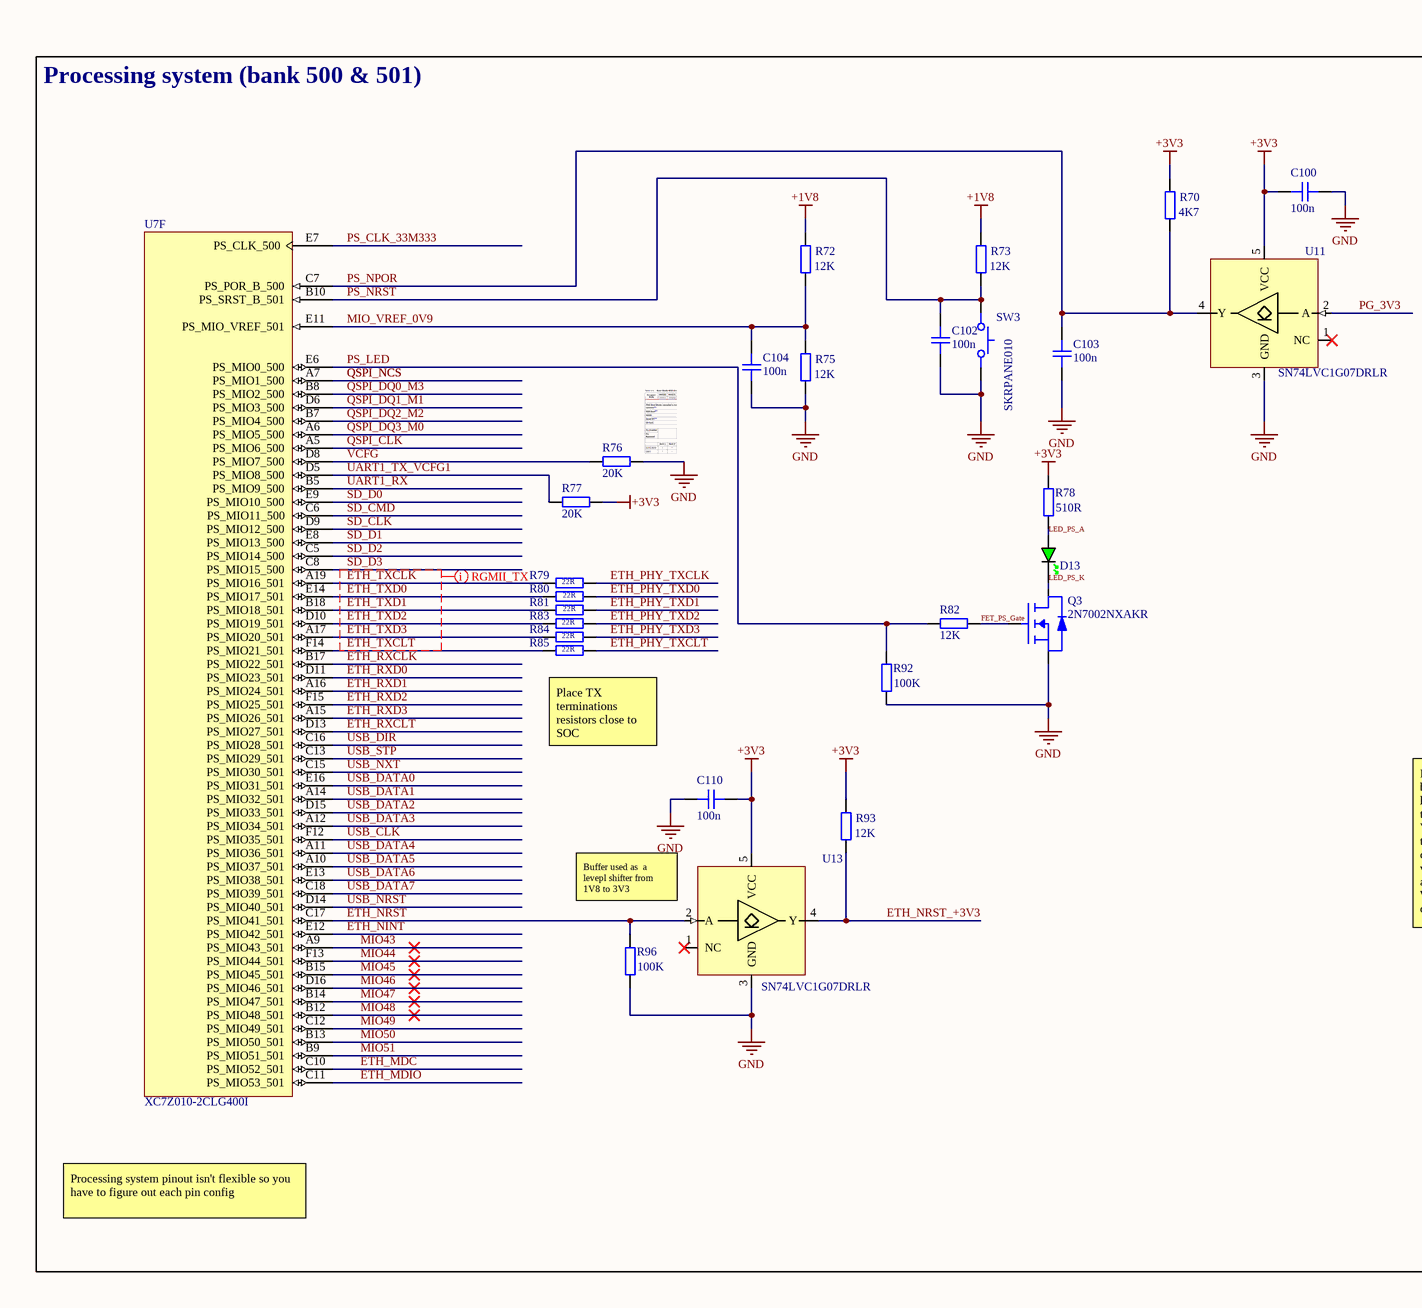
[diagram p4: Zynq processing system (PS).SchDoc, left]
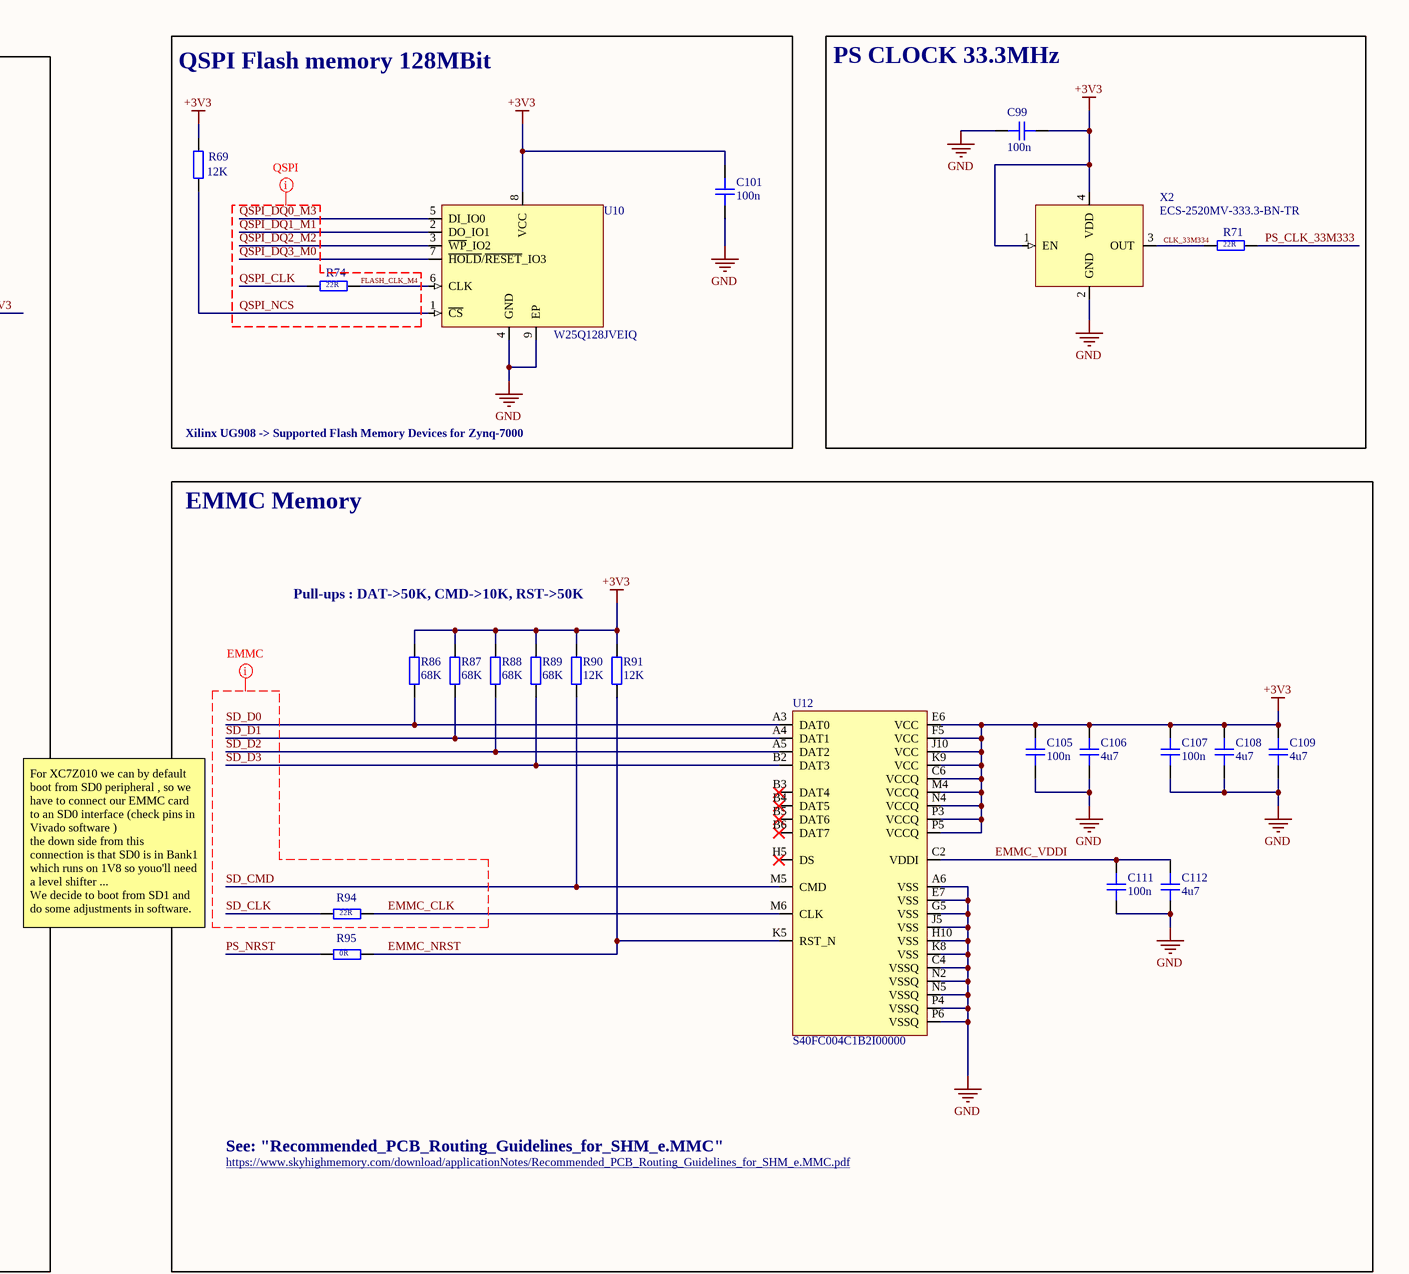
[diagram p5: Zynq processing system (PS).SchDoc, right]

### Parts
C99  100n  [CAP_0402]
C100  100n  [CAP_0402]
C101  100n  [CAP_0402]
C102  100n  [CAP_0402]
C103  100n  [CAP_0402]
C104  100n  [CAP_0402]
C105  100n  [CAP_0402]
C106  4u7  [CAP_0402]
C107  100n  [CAP_0402]
C108  4u7  [CAP_0402]
C109  4u7  [CAP_0402]
C110  100n  [CAP_0402]
C111  100n  [CAP_0402]
C112  4u7  [CAP_0402]
D13  GREEN  [LED_0402_GREEN]  (value not drawn)
Q3  2N7002NXAKR  [SSM3J338R,LF-SOT23-F]
R69  value 12K  [RES_0402]  (hidden comment: R0402)
R70  value 4K7  [RES_0402]  (hidden comment: R0402)
R71  value 22R  [RES_0402]  (hidden comment: R0402)
R72  value 12K  [RES_0402]  (hidden comment: R0402)
R73  value 12K  [RES_0402]  (hidden comment: R0402)
R74  value 22R  [RES_0402]  (hidden comment: R0402)
R75  value 12K  [RES_0402]  (hidden comment: R0402)
R76  value 20K  [RES_0402]  (hidden comment: R0402)
R77  value 20K  [RES_0402]  (hidden comment: R0402)
R78  value 510R  [RES_0402]  (hidden comment: R0402)
R79  value 22R  [RES_0402]  (hidden comment: R0402)
R80  value 22R  [RES_0402]  (hidden comment: R0402)
R81  value 22R  [RES_0402]  (hidden comment: R0402)
R82  value 12K  [RES_0402]  (hidden comment: R0402)
R83  value 22R  [RES_0402]  (hidden comment: R0402)
R84  value 22R  [RES_0402]  (hidden comment: R0402)
R85  value 22R  [RES_0402]  (hidden comment: R0402)
R86  value 68K  [RES_0402]  (hidden comment: R0402)
R87  value 68K  [RES_0402]  (hidden comment: R0402)
R88  value 68K  [RES_0402]  (hidden comment: R0402)
R89  value 68K  [RES_0402]  (hidden comment: R0402)
R90  value 12K  [RES_0402]  (hidden comment: R0402)
R91  value 12K  [RES_0402]  (hidden comment: R0402)
R92  value 100K  [RES_0402]  (hidden comment: R0402)
R93  value 12K  [RES_0402]  (hidden comment: R0402)
R94  value 22R  [RES_0402]  (hidden comment: R0402)
R95  value 0R  [RES_0402]  (hidden comment: R0402)
R96  value 100K  [RES_0402]  (hidden comment: R0402)
SW3  SKRPANE010  [SKRPANE010]
U7  XC7Z010-2CLG400I  [BGA400C80P20X20_1700X1700X160N]  (part F of 9)
U10  W25Q128JVEIQ  [WSON-8-8X6]
U11  SN74LVC1G07DRLR  [SOT-5]
U12  S40FC004C1B2I00000  [VFBGA153-9.0x7.5x0.8]
U13  SN74LVC1G07DRLR  [SOT-5]
X2  ECS-2520MV-333.3-BN-TR  [XTAL_2520]

### Blocks framed on the sheet
Processing system (bank 500 & 501): C100 C102-C104 C110 D13 Q3 R70 R72 R73 R75-R85 R92 R93 R96 SW3 U7 U11 U13
QSPI Flash memory 128MBit: C101 R69 R74 U10
PS CLOCK 33.3MHz: C99 R71 X2
EMMC Memory: C105-C109 C111 C112 R86-R91 R94 R95 U12

### Nets
+1V8: R72.2 R73.2
+3V3: C99.1 C100.2 C101.1 C105.1 C106.1 C107.1 C108.1 C109.1 C110.2 R69.2 R70.2 R77.1 R78.1 R86.1 R87.1 R88.1 R89.1 R90.1 R91.1 R93.2 U10.8(VCC) U11.5(VCC) U12.C6(VCCQ) U12.E6(VCC) U12.F5(VCC) U12.J10(VCC) U12.K9(VCC) U12.M4(VCCQ) U12.N4(VCCQ) U12.P3(VCCQ) U12.P5(VCCQ) U13.5(VCC) X2.1(EN) X2.4(VDD)
GND: C99.2 C100.1 C101.2 C102.2 C103.2 C104.2 C105.2 C106.2 C107.2 C108.2 C109.2 C110.1 C111.2 C112.2 Q3.S R75.1 R76.1 R92.2 R96.2 SW3.12 U10.4(GND) U10.9(EP) U11.3(GND) U12.A6(VSS) U12.C4(VSSQ) U12.E7(VSS) U12.G5(VSS) U12.H10(VSS) U12.J5(VSS) U12.K8(VSS) U12.N2(VSSQ) U12.N5(VSSQ) U12.P4(VSSQ) U12.P6(VSSQ) U13.3(GND) X2.2(GND)
CLK_33M334: R71.2 X2.3(OUT)
EMMC_CLK: R94.1 U12.M6(CLK)
EMMC_NRST: R91.2 R95.1 U12.K5(RST_N)
EMMC_VDDI: C111.1 C112.1 U12.C2(VDDI)
ETH_MDC: U7.C10(PS_MIO52_501)
ETH_MDIO: U7.C11(PS_MIO53_501)
ETH_NINT: U7.E12(PS_MIO42_501)
ETH_NRST: R96.1 U7.C17(PS_MIO41_501) U13.2(A)
ETH_NRST_+3V3: R93.1 U13.4(Y)
ETH_PHY_TXCLK: R79.1
ETH_PHY_TXCLT: R85.1
ETH_PHY_TXD0: R80.1
ETH_PHY_TXD1: R81.1
ETH_PHY_TXD2: R83.1
ETH_PHY_TXD3: R84.1
ETH_RXCLK: U7.B17(PS_MIO22_501)
ETH_RXCLT: U7.D13(PS_MIO27_501)
ETH_RXD0: U7.D11(PS_MIO23_501)
ETH_RXD1: U7.A16(PS_MIO24_501)
ETH_RXD2: U7.F15(PS_MIO25_501)
ETH_RXD3: U7.A15(PS_MIO26_501)
ETH_TXCLK: R79.2 U7.A19(PS_MIO16_501)
ETH_TXCLT: R85.2 U7.F14(PS_MIO21_501)
ETH_TXD0: R80.2 U7.E14(PS_MIO17_501)
ETH_TXD1: R81.2 U7.B18(PS_MIO18_501)
ETH_TXD2: R83.2 U7.D10(PS_MIO19_501)
ETH_TXD3: R84.2 U7.A17(PS_MIO20_501)
FET_PS_Gate: Q3.G R82.1
FLASH_CLK_M4: R74.1 U10.6(CLK)
LED_PS_A: D13.A R78.2
LED_PS_K: D13.K Q3.D
MIO43: U7.A9(PS_MIO43_501)
MIO44: U7.F13(PS_MIO44_501)
MIO45: U7.B15(PS_MIO45_501)
MIO46: U7.D16(PS_MIO46_501)
MIO47: U7.B14(PS_MIO47_501)
MIO48: U7.B12(PS_MIO48_501)
MIO49: U7.C12(PS_MIO49_501)
MIO50: U7.B13(PS_MIO50_501)
MIO51: U7.B9(PS_MIO51_501)
MIO_VREF_0V9: C104.1 R72.1 R75.2 U7.E11(PS_MIO_VREF_501)
PG_3V3: U11.2(A)
PS_CLK_33M333: R71.1 U7.E7(PS_CLK_500)
PS_LED: R82.2 R92.1 U7.E6(PS_MIO0_500)
PS_NPOR: C103.1 R70.1 U7.C7(PS_POR_B_500) U11.4(Y)
PS_NRST: C102.1 R73.1 R95.2 SW3.34 U7.B10(PS_SRST_B_501)
QSPI_CLK: R74.2 U7.A5(PS_MIO6_500)
QSPI_DQ0_M3: U7.B8(PS_MIO2_500) U10.5(DI_IO0)
QSPI_DQ1_M1: U7.D6(PS_MIO3_500) U10.2(DO_IO1)
QSPI_DQ2_M2: U7.B7(PS_MIO4_500) U10.3(~{WP}_IO2)
QSPI_DQ3_M0: U7.A6(PS_MIO5_500) U10.7(~{HOLD}/~{RESET}_IO3)
QSPI_NCS: R69.1 U7.A7(PS_MIO1_500) U10.1(~{CS})
SD_CLK: R94.2 U7.D9(PS_MIO12_500)
SD_CMD: R90.2 U7.C6(PS_MIO11_500) U12.M5(CMD)
SD_D0: R86.2 U7.E9(PS_MIO10_500) U12.A3(DAT0)
SD_D1: R87.2 U7.E8(PS_MIO13_500) U12.A4(DAT1)
SD_D2: R88.2 U7.C5(PS_MIO14_500) U12.A5(DAT2)
SD_D3: R89.2 U7.C8(PS_MIO15_500) U12.B2(DAT3)
UART1_RX: U7.B5(PS_MIO9_500)
UART1_TX_VCFG1: R77.2 U7.D5(PS_MIO8_500)
USB_CLK: U7.F12(PS_MIO35_501)
USB_DATA0: U7.E16(PS_MIO31_501)
USB_DATA1: U7.A14(PS_MIO32_501)
USB_DATA2: U7.D15(PS_MIO33_501)
USB_DATA3: U7.A12(PS_MIO34_501)
USB_DATA4: U7.A11(PS_MIO36_501)
USB_DATA5: U7.A10(PS_MIO37_501)
USB_DATA6: U7.E13(PS_MIO38_501)
USB_DATA7: U7.C18(PS_MIO39_501)
USB_DIR: U7.C16(PS_MIO28_501)
USB_NRST: U7.D14(PS_MIO40_501)
USB_NXT: U7.C15(PS_MIO30_501)
USB_STP: U7.C13(PS_MIO29_501)
VCFG: R76.2 U7.D8(PS_MIO7_500)

Not connected (* = marked no-connect by the designer): U11 1(NC)*; U12 B3(DAT4)* B4(DAT5)* B5(DAT6)* B6(DAT7)* H5(DS)*; U13 1(NC)*

### Layout directives
net class QSPI: FLASH_CLK_M4, QSPI_CLK, QSPI_DQ0_M3, QSPI_DQ1_M1, QSPI_DQ2_M2, QSPI_DQ3_M0, QSPI_NCS
net class RGMII_TX; rule Matched Net Lengths [Delay Tolerance = 20ps]: ETH_TXCLK, ETH_TXCLT, ETH_TXD0, ETH_TXD1, ETH_TXD2, ETH_TXD3, SD_D3
net class EMMC; rule Matched Net Lengths [Delay Tolerance = 20ps]; rule Width Constraint [Pref Impedance = 50.00ohms    Min Impedance = 50.00ohms    Max Impedance = 50.00ohms]: EMMC_CLK, SD_CLK, SD_CMD, SD_D0, SD_D1, SD_D2, SD_D3

### Notes on the sheet
- Xilinx UG908 -> Supported Flash Memory Devices for Zynq-7000
- Pull-ups : DAT->50K, CMD->10K, RST->50K
- Place TX terminations resistors close to SOC
- (near U13) Buffer used as  a levepl shifter from 1V8 to 3V3
- For XC7Z010 we can by default boot from SD0 peripheral , so we have to connect our EMMC card to an SD0 interface (check pins in Vivado software )
  the down side from this connection is that SD0 is in Bank1 which runs on 1V8 so youo'll need a level shifter ...
  We decide to boot from SD1 and do some adjustments in software.
- See: "Recommended_PCB_Routing_Guidelines_for_SHM_e.MMC"
- https://www.skyhighmemory.com/download/applicationNotes/Recommended_PCB_Routing_Guidelines_for_SHM_e.MMC.pdf
- Processing system pinout isn't flexible so you have to figure out each pin config

### Library data of the parts
C99-C112 = CAP_0402: Capacitor SMD 0402; Manufacturer: *; Manufacturer Part Number: *; Distributor Link: *; LCSC: *; Rating: *; Dielectric: *
D13 = LED_0402_GREEN: LED 0402 GREEN SMD
Q3 = 2N7002NXAKR: as Q1 on sheet Power_supplies; Manufacturer Part Number: 2N7002NXAKR
R69-R96 = RES_0402: Resistor SMD 0402; Manufacturer: *; Manufacturer Part Number: *; Distributor Link: *; LCSC: *
SW3 = SKRPANE010: Tactile Switch SMD SPST; Manufacturer: Alps Alpine; Manufacturer Part Number: SKRPANE010
U10 = W25Q128JVEIQ: 3V 128M-BIT SERIAL FLASH MEMORY WITH DUAL/QUAD SPI & QPI & DTR WSON-8; Manufacturer: Winbond; Manufacturer Part Number: W25Q128JVEIQ
U11 U13 = SN74LVC1G07DRLR: Single Buffer/Driver With Open-Drain Output; Manufacturer: Texas Instruments; Manufacturer Part Number: SN74LVC1G07DRLR; Distributor Link: https://www.mouser.de/ProductDetail/Texas-Instruments/SN74LVC1G07DRLR?qs=pajgIaoyDUjwau6f5T7MtQ%3D%3D; LCSC: C183013
U12 = S40FC004C1B2I00000: eMMC MLC Memory 4GB 3V3; Manufacturer: SkyHigh Memory; Manufacturer Part Number: S40FC004C1B2I00000
X2 = ECS-2520MV-130-BN-TR: as X1 on sheet Zynq config, JTAG, Debug; Manufacturer Part Number: ECS-2520MV-130-BN-TR

## Sheet Zynq programmable logic (PL).SchDoc
size A3; SheetNumber: 6; SheetTotal: 11
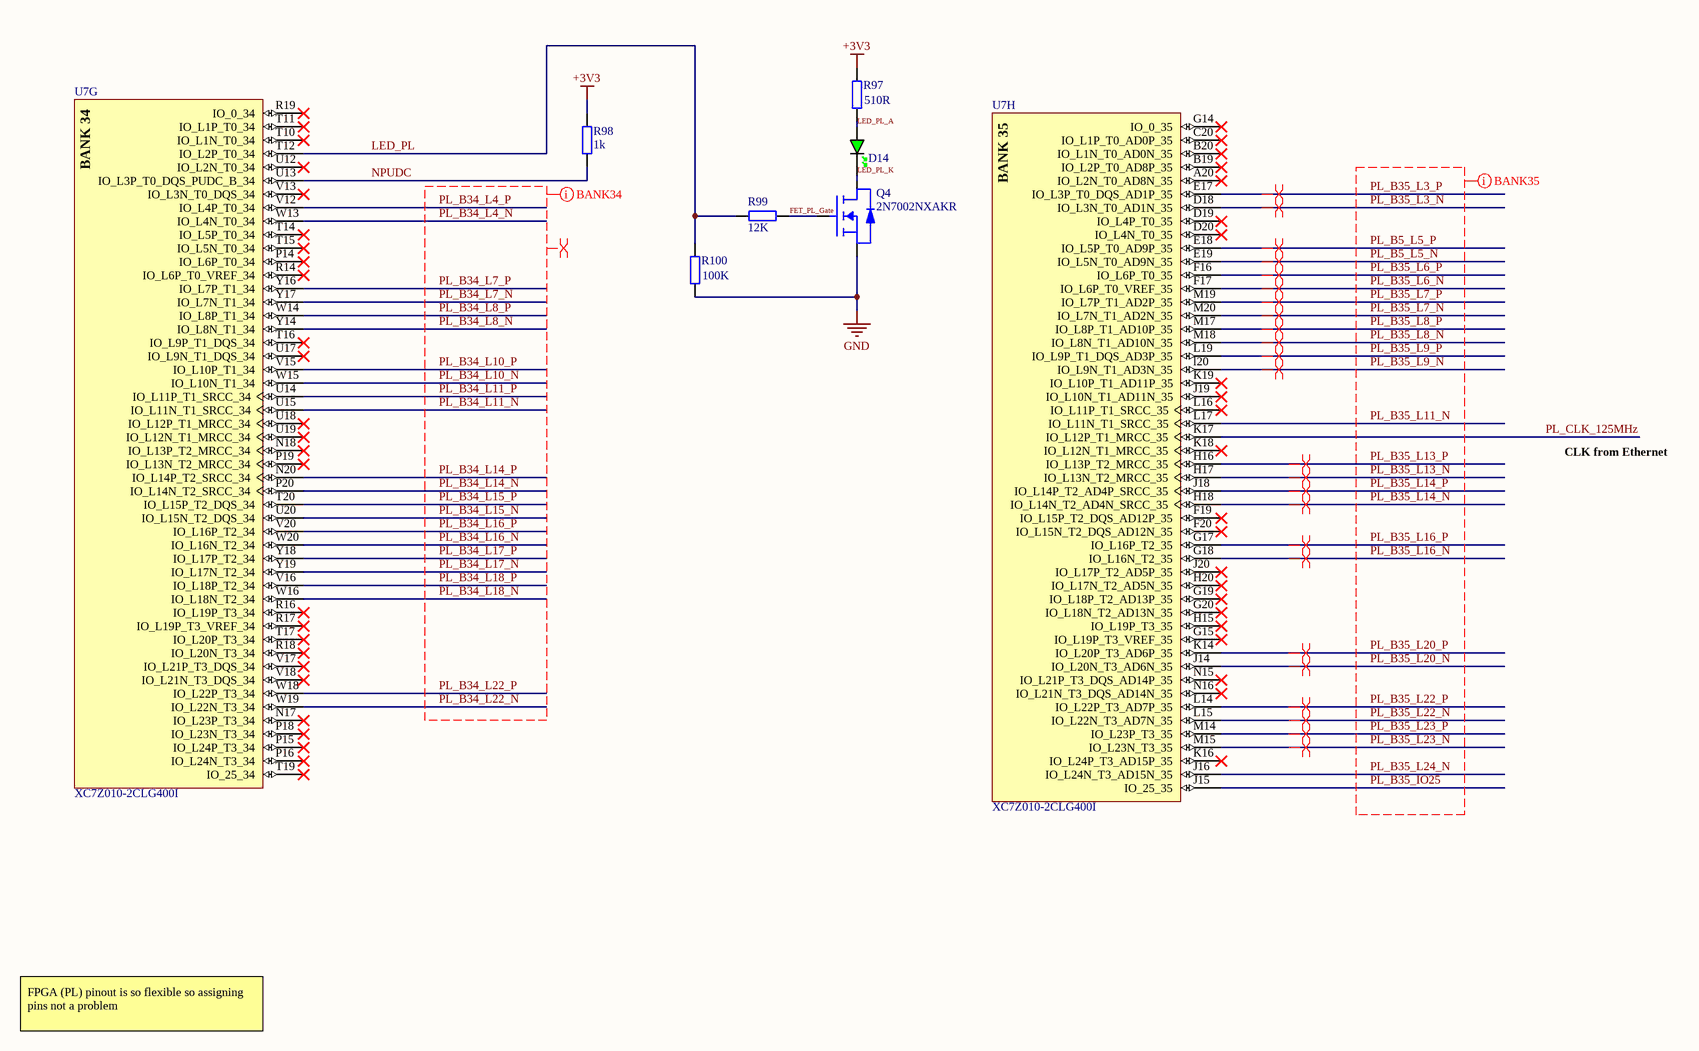
[diagram p6: Zynq programmable logic (PL).SchDoc]

### Parts
D14  GREEN  [LED_0402_GREEN]  (value not drawn)
Q4  2N7002NXAKR  [SSM3J338R,LF-SOT23-F]
R97  value 510R  [RES_0402]  (hidden comment: R0402)
R98  value 1k  [RES_0402]  (hidden comment: R0402)
R99  value 12K  [RES_0402]  (hidden comment: R0402)
R100  value 100K  [RES_0402]  (hidden comment: R0402)
U7  XC7Z010-2CLG400I  [BGA400C80P20X20_1700X1700X160N]  (parts G,H of 9)

### Nets
+3V3: R97.1 R98.1
GND: Q4.S R100.2
FET_PL_Gate: Q4.G R99.1
LED_PL: R99.2 R100.1 U7.T12(IO_L2P_T0_34)
LED_PL_A: D14.A R97.2
LED_PL_K: D14.K Q4.D
NPUDC: R98.2 U7.U13(IO_L3P_T0_DQS_PUDC_B_34)
PL_B5_L5_N: U7.E19(IO_L5N_T0_AD9N_35)
PL_B5_L5_P: U7.E18(IO_L5P_T0_AD9P_35)
PL_B34_L4_N: U7.W13(IO_L4N_T0_34)
PL_B34_L4_P: U7.V12(IO_L4P_T0_34)
PL_B34_L7_N: U7.Y17(IO_L7N_T1_34)
PL_B34_L7_P: U7.Y16(IO_L7P_T1_34)
PL_B34_L8_N: U7.Y14(IO_L8N_T1_34)
PL_B34_L8_P: U7.W14(IO_L8P_T1_34)
PL_B34_L10_N: U7.W15(IO_L10N_T1_34)
PL_B34_L10_P: U7.V15(IO_L10P_T1_34)
PL_B34_L11_N: U7.U15(IO_L11N_T1_SRCC_34)
PL_B34_L11_P: U7.U14(IO_L11P_T1_SRCC_34)
PL_B34_L14_N: U7.P20(IO_L14N_T2_SRCC_34)
PL_B34_L14_P: U7.N20(IO_L14P_T2_SRCC_34)
PL_B34_L15_N: U7.U20(IO_L15N_T2_DQS_34)
PL_B34_L15_P: U7.T20(IO_L15P_T2_DQS_34)
PL_B34_L16_N: U7.W20(IO_L16N_T2_34)
PL_B34_L16_P: U7.V20(IO_L16P_T2_34)
PL_B34_L17_N: U7.Y19(IO_L17N_T2_34)
PL_B34_L17_P: U7.Y18(IO_L17P_T2_34)
PL_B34_L18_N: U7.W16(IO_L18N_T2_34)
PL_B34_L18_P: U7.V16(IO_L18P_T2_34)
PL_B34_L22_N: U7.W19(IO_L22N_T3_34)
PL_B34_L22_P: U7.W18(IO_L22P_T3_34)
PL_B35_IO25: U7.J15(IO_25_35)
PL_B35_L3_N: U7.D18(IO_L3N_T0_AD1N_35)
PL_B35_L3_P: U7.E17(IO_L3P_T0_DQS_AD1P_35)
PL_B35_L6_N: U7.F17(IO_L6P_T0_VREF_35)
PL_B35_L6_P: U7.F16(IO_L6P_T0_35)
PL_B35_L7_N: U7.M20(IO_L7N_T1_AD2N_35)
PL_B35_L7_P: U7.M19(IO_L7P_T1_AD2P_35)
PL_B35_L8_N: U7.M18(IO_L8N_T1_AD10N_35)
PL_B35_L8_P: U7.M17(IO_L8P_T1_AD10P_35)
PL_B35_L9_N: U7.l20(IO_L9N_T1_AD3N_35)
PL_B35_L9_P: U7.L19(IO_L9P_T1_DQS_AD3P_35)
PL_B35_L11_N: U7.L17(IO_L11N_T1_SRCC_35)
PL_B35_L13_N: U7.H17(IO_L13N_T2_MRCC_35)
PL_B35_L13_P: U7.H16(IO_L13P_T2_MRCC_35)
PL_B35_L14_N: U7.H18(IO_L14N_T2_AD4N_SRCC_35)
PL_B35_L14_P: U7.J18(IO_L14P_T2_AD4P_SRCC_35)
PL_B35_L16_N: U7.G18(IO_L16N_T2_35)
PL_B35_L16_P: U7.G17(IO_L16P_T2_35)
PL_B35_L20_N: U7.J14(IO_L20N_T3_AD6N_35)
PL_B35_L20_P: U7.K14(IO_L20P_T3_AD6P_35)
PL_B35_L22_N: U7.L15(IO_L22N_T3_AD7N_35)
PL_B35_L22_P: U7.L14(IO_L22P_T3_AD7P_35)
PL_B35_L23_N: U7.M15(IO_L23N_T3_35)
PL_B35_L23_P: U7.M14(IO_L23P_T3_35)
PL_B35_L24_N: U7.J16(IO_L24N_T3_AD15N_35)
PL_CLK_125MHz: U7.K17(IO_L12P_T1_MRCC_35)

Not connected (* = marked no-connect by the designer): U7 A20(IO_L2N_T0_AD8N_35)* B19(IO_L2P_T0_AD8P_35)* B20(IO_L1N_T0_AD0N_35)* C20(IO_L1P_T0_AD0P_35)* D19(IO_L4P_T0_35)* D20(IO_L4N_T0_35)* F19(IO_L15P_T2_DQS_AD12P_35)* F20(IO_L15N_T2_DQS_AD12N_35)* G14(IO_0_35)* G15(IO_L19P_T3_VREF_35)* G19(IO_L18P_T2_AD13P_35)* G20(IO_L18N_T2_AD13N_35)* H15(IO_L19P_T3_35)* H20(IO_L17N_T2_AD5N_35)* J19(IO_L10N_T1_AD11N_35)* J20(IO_L17P_T2_AD5P_35)* K16(IO_L24P_T3_AD15P_35)* K18(IO_L12N_T1_MRCC_35)* K19(IO_L10P_T1_AD11P_35)* L16(IO_L11P_T1_SRCC_35)* N15(IO_L21P_T3_DQS_AD14P_35)* N16(IO_L21N_T3_DQS_AD14N_35)* N17(IO_L23P_T3_34)* N18(IO_L13P_T2_MRCC_34)* P14(IO_L6P_T0_34)* P15(IO_L24P_T3_34)* P16(IO_L24N_T3_34)* P18(IO_L23N_T3_34)* P19(IO_L13N_T2_MRCC_34)* R14(IO_L6P_T0_VREF_34)* R16(IO_L19P_T3_34)* R17(IO_L19P_T3_VREF_34)* R18(IO_L20N_T3_34)* R19(IO_0_34)* T10(IO_L1N_T0_34)* T11(IO_L1P_T0_34)* T14(IO_L5P_T0_34)* T15(IO_L5N_T0_34)* T16(IO_L9P_T1_DQS_34)* T17(IO_L20P_T3_34)* T19(IO_25_34)* U12(IO_L2N_T0_34)* U17(IO_L9N_T1_DQS_34)* U18(IO_L12P_T1_MRCC_34)* U19(IO_L12N_T1_MRCC_34)* V13(IO_L3N_T0_DQS_34)* V17(IO_L21P_T3_DQS_34)* V18(IO_L21N_T3_DQS_34)*

### Layout directives
differential pair; differential pair class 100ohm: PL_B5_L5_N, PL_B5_L5_P, PL_B34_L4_N, PL_B34_L4_P, PL_B34_L7_N, PL_B34_L7_P, PL_B34_L8_N, PL_B34_L8_P, PL_B34_L10_N, PL_B34_L10_P, PL_B34_L11_N, PL_B34_L11_P, PL_B34_L14_N, PL_B34_L14_P, PL_B34_L15_N, PL_B34_L15_P, PL_B34_L16_N, PL_B34_L16_P, PL_B34_L17_N, PL_B34_L17_P, PL_B34_L18_N, PL_B34_L18_P, PL_B34_L22_N, PL_B34_L22_P, PL_B35_L3_N, PL_B35_L3_P, PL_B35_L6_N, PL_B35_L6_P, PL_B35_L7_N, PL_B35_L7_P, PL_B35_L8_N, PL_B35_L8_P, PL_B35_L9_N, PL_B35_L9_P, PL_B35_L13_N, PL_B35_L13_P, PL_B35_L14_N, PL_B35_L14_P, PL_B35_L16_N, PL_B35_L16_P, PL_B35_L20_N, PL_B35_L20_P, PL_B35_L22_N, PL_B35_L22_P, PL_B35_L23_N, PL_B35_L23_P
net class BANK34: PL_B34_L4_N, PL_B34_L4_P, PL_B34_L7_N, PL_B34_L7_P, PL_B34_L8_N, PL_B34_L8_P, PL_B34_L10_N, PL_B34_L10_P, PL_B34_L11_N, PL_B34_L11_P, PL_B34_L14_N, PL_B34_L14_P, PL_B34_L15_N, PL_B34_L15_P, PL_B34_L16_N, PL_B34_L16_P, PL_B34_L17_N, PL_B34_L17_P, PL_B34_L18_N, PL_B34_L18_P, PL_B34_L22_N, PL_B34_L22_P
net class BANK35: PL_B5_L5_N, PL_B5_L5_P, PL_B35_IO25, PL_B35_L3_N, PL_B35_L3_P, PL_B35_L6_N, PL_B35_L6_P, PL_B35_L7_N, PL_B35_L7_P, PL_B35_L8_N, PL_B35_L8_P, PL_B35_L9_N, PL_B35_L9_P, PL_B35_L11_N, PL_B35_L13_N, PL_B35_L13_P, PL_B35_L14_N, PL_B35_L14_P, PL_B35_L16_N, PL_B35_L16_P, PL_B35_L20_N, PL_B35_L20_P, PL_B35_L22_N, PL_B35_L22_P, PL_B35_L23_N, PL_B35_L23_P, PL_B35_L24_N

### Notes on the sheet
- CLK from Ethernet
- FPGA (PL) pinout is so flexible so assigning pins not a problem
- (in symbol XC7Z010-2CLG400I, part G) BANK 34
- (in symbol XC7Z010-2CLG400I, part H) BANK 35

### Library data of the parts
D14 = LED_0402_GREEN: LED 0402 GREEN SMD
Q4 = 2N7002NXAKR: as Q1 on sheet Power_supplies; Manufacturer Part Number: 2N7002NXAKR
R97-R100 = RES_0402: Resistor SMD 0402; Manufacturer: *; Manufacturer Part Number: *; Distributor Link: *; LCSC: *

## Sheet Zynq DDR Interface & Termination.SchDoc
size A3; SheetNumber: 7; SheetTotal: 11
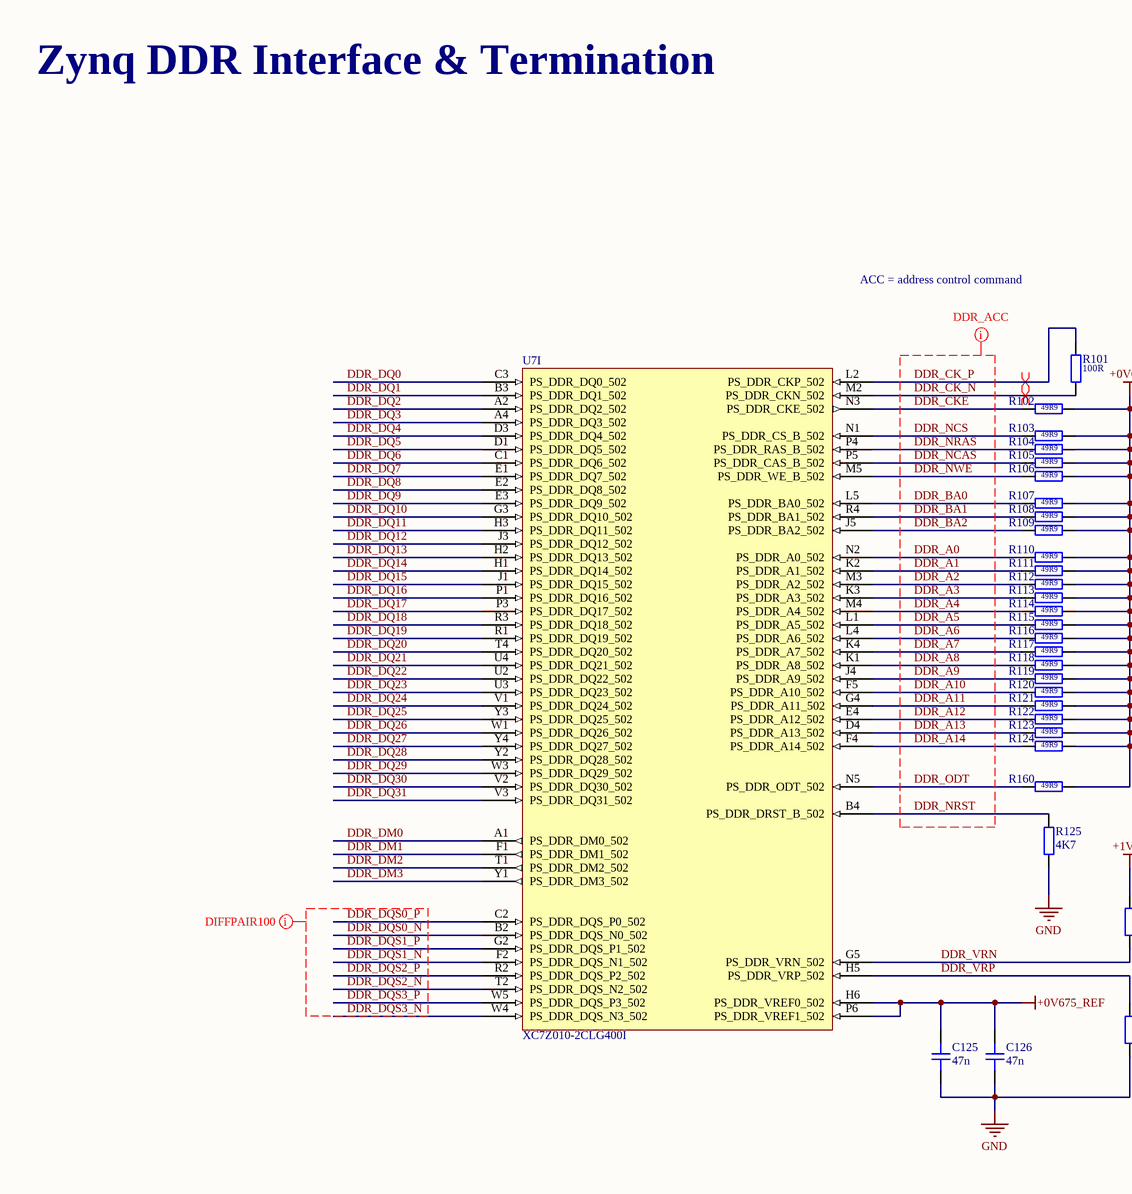
[diagram p7: Zynq DDR Interface & Termination.SchDoc, left]
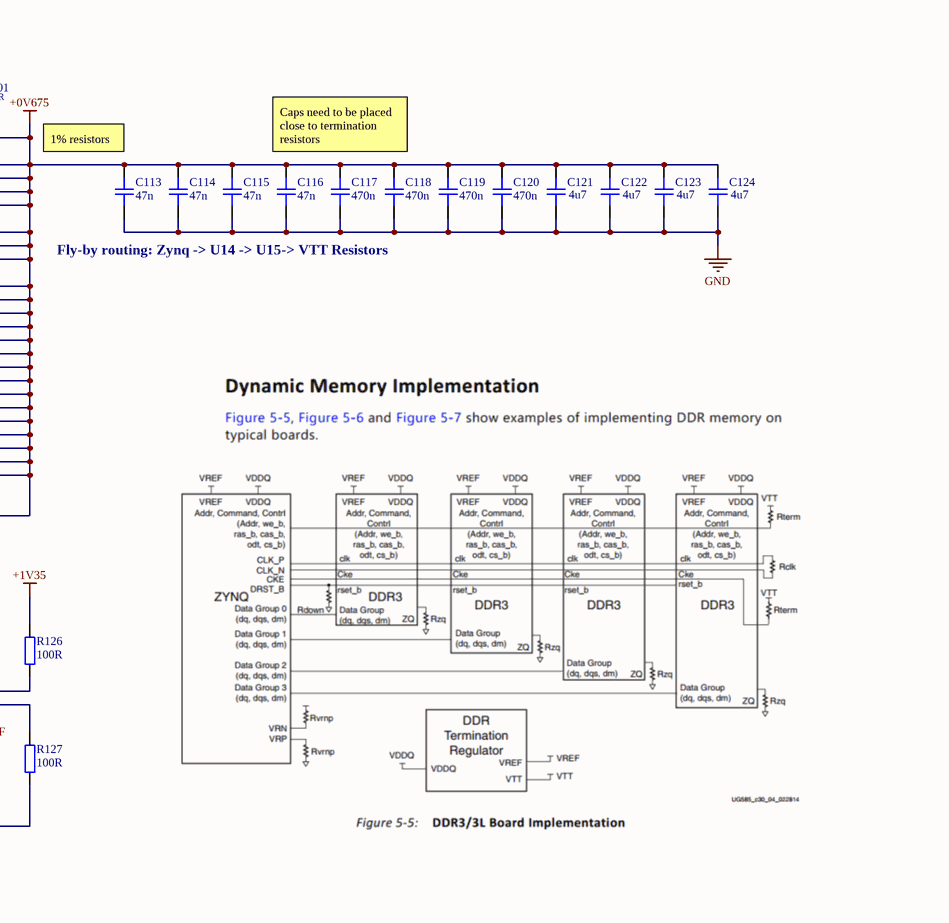
[diagram p8: Zynq DDR Interface & Termination.SchDoc, middle]

### Parts
C113  value 47n  [CAP_0201]  (hidden comment: C0201)
C114  value 47n  [CAP_0201]  (hidden comment: C0201)
C115  value 47n  [CAP_0201]  (hidden comment: C0201)
C116  value 47n  [CAP_0201]  (hidden comment: C0201)
C117  value 470n  [CAP_0201]  (hidden comment: C0201)
C118  value 470n  [CAP_0201]  (hidden comment: C0201)
C119  value 470n  [CAP_0201]  (hidden comment: C0201)
C120  value 470n  [CAP_0201]  (hidden comment: C0201)
C121  value 4u7  [CAP_0402]  (hidden comment: C0402)
C122  value 4u7  [CAP_0402]  (hidden comment: C0402)
C123  value 4u7  [CAP_0402]  (hidden comment: C0402)
C124  value 4u7  [CAP_0402]  (hidden comment: C0402)
C125  value 47n  [CAP_0201]  (hidden comment: C0201)
C126  value 47n  [CAP_0201]  (hidden comment: C0201)
R101  value 100R  [RES_0201]  (hidden comment: R0201)
R102  value 49R9  [RES_0201]  (hidden comment: R0201)
R103  value 49R9  [RES_0201]  (hidden comment: R0201)
R104  value 49R9  [RES_0201]  (hidden comment: R0201)
R105  value 49R9  [RES_0201]  (hidden comment: R0201)
R106  value 49R9  [RES_0201]  (hidden comment: R0201)
R107  value 49R9  [RES_0201]  (hidden comment: R0201)
R108  value 49R9  [RES_0201]  (hidden comment: R0201)
R109  value 49R9  [RES_0201]  (hidden comment: R0201)
R110  value 49R9  [RES_0201]  (hidden comment: R0201)
R111  value 49R9  [RES_0201]  (hidden comment: R0201)
R112  value 49R9  [RES_0201]  (hidden comment: R0201)
R113  value 49R9  [RES_0201]  (hidden comment: R0201)
R114  value 49R9  [RES_0201]  (hidden comment: R0201)
R115  value 49R9  [RES_0201]  (hidden comment: R0201)
R116  value 49R9  [RES_0201]  (hidden comment: R0201)
R117  value 49R9  [RES_0201]  (hidden comment: R0201)
R118  value 49R9  [RES_0201]  (hidden comment: R0201)
R119  value 49R9  [RES_0201]  (hidden comment: R0201)
R120  value 49R9  [RES_0201]  (hidden comment: R0201)
R121  value 49R9  [RES_0201]  (hidden comment: R0201)
R122  value 49R9  [RES_0201]  (hidden comment: R0201)
R123  value 49R9  [RES_0201]  (hidden comment: R0201)
R124  value 49R9  [RES_0201]  (hidden comment: R0201)
R125  value 4K7  [RES_0402]  (hidden comment: R0402)
R126  value 100R  [RES_0402]  (hidden comment: R0402)
R127  value 100R  [RES_0402]  (hidden comment: R0402)
R160  value 49R9  [RES_0201]  (hidden comment: R0201)
U7  XC7Z010-2CLG400I  [BGA400C80P20X20_1700X1700X160N]  (part I of 9)

### Nets
+0V675: C113.2 C114.2 C115.2 C116.2 C117.2 C118.2 C119.2 C120.2 C121.2 C122.2 C123.2 C124.2 R102.2 R103.2 R104.2 R105.2 R106.2 R107.2 R108.2 R109.2 R110.2 R111.2 R112.2 R113.2 R114.2 R115.2 R116.2 R117.2 R118.2 R119.2 R120.2 R121.2 R122.2 R123.2 R124.2 R160.2
+0V675_Ref: C125.2 C126.2 U7.H6(PS_DDR_VREF0_502) U7.P6(PS_DDR_VREF1_502)
+1V35: R126.1
GND: C113.1 C114.1 C115.1 C116.1 C117.1 C118.1 C119.1 C120.1 C121.1 C122.1 C123.1 C124.1 C125.1 C126.1 R125.2 R127.2
DDR_A0: R110.1 U7.N2(PS_DDR_A0_502)
DDR_A1: R111.1 U7.K2(PS_DDR_A1_502)
DDR_A2: R112.1 U7.M3(PS_DDR_A2_502)
DDR_A3: R113.1 U7.K3(PS_DDR_A3_502)
DDR_A4: R114.1 U7.M4(PS_DDR_A4_502)
DDR_A5: R115.1 U7.L1(PS_DDR_A5_502)
DDR_A6: R116.1 U7.L4(PS_DDR_A6_502)
DDR_A7: R117.1 U7.K4(PS_DDR_A7_502)
DDR_A8: R118.1 U7.K1(PS_DDR_A8_502)
DDR_A9: R119.1 U7.J4(PS_DDR_A9_502)
DDR_A10: R120.1 U7.F5(PS_DDR_A10_502)
DDR_A11: R121.1 U7.G4(PS_DDR_A11_502)
DDR_A12: R122.1 U7.E4(PS_DDR_A12_502)
DDR_A13: R123.1 U7.D4(PS_DDR_A13_502)
DDR_A14: R124.1 U7.F4(PS_DDR_A14_502)
DDR_BA0: R107.1 U7.L5(PS_DDR_BA0_502)
DDR_BA1: R108.1 U7.R4(PS_DDR_BA1_502)
DDR_BA2: R109.1 U7.J5(PS_DDR_BA2_502)
DDR_CK_N: R101.1 U7.M2(PS_DDR_CKN_502)
DDR_CK_P: R101.2 U7.L2(PS_DDR_CKP_502)
DDR_CKE: R102.1 U7.N3(PS_DDR_CKE_502)
DDR_DM0: U7.A1(PS_DDR_DM0_502)
DDR_DM1: U7.F1(PS_DDR_DM1_502)
DDR_DM2: U7.T1(PS_DDR_DM2_502)
DDR_DM3: U7.Y1(PS_DDR_DM3_502)
DDR_DQ0: U7.C3(PS_DDR_DQ0_502)
DDR_DQ1: U7.B3(PS_DDR_DQ1_502)
DDR_DQ2: U7.A2(PS_DDR_DQ2_502)
DDR_DQ3: U7.A4(PS_DDR_DQ3_502)
DDR_DQ4: U7.D3(PS_DDR_DQ4_502)
DDR_DQ5: U7.D1(PS_DDR_DQ5_502)
DDR_DQ6: U7.C1(PS_DDR_DQ6_502)
DDR_DQ7: U7.E1(PS_DDR_DQ7_502)
DDR_DQ8: U7.E2(PS_DDR_DQ8_502)
DDR_DQ9: U7.E3(PS_DDR_DQ9_502)
DDR_DQ10: U7.G3(PS_DDR_DQ10_502)
DDR_DQ11: U7.H3(PS_DDR_DQ11_502)
DDR_DQ12: U7.J3(PS_DDR_DQ12_502)
DDR_DQ13: U7.H2(PS_DDR_DQ13_502)
DDR_DQ14: U7.H1(PS_DDR_DQ14_502)
DDR_DQ15: U7.J1(PS_DDR_DQ15_502)
DDR_DQ16: U7.P1(PS_DDR_DQ16_502)
DDR_DQ17: U7.P3(PS_DDR_DQ17_502)
DDR_DQ18: U7.R3(PS_DDR_DQ18_502)
DDR_DQ19: U7.R1(PS_DDR_DQ19_502)
DDR_DQ20: U7.T4(PS_DDR_DQ20_502)
DDR_DQ21: U7.U4(PS_DDR_DQ21_502)
DDR_DQ22: U7.U2(PS_DDR_DQ22_502)
DDR_DQ23: U7.U3(PS_DDR_DQ23_502)
DDR_DQ24: U7.V1(PS_DDR_DQ24_502)
DDR_DQ25: U7.Y3(PS_DDR_DQ25_502)
DDR_DQ26: U7.W1(PS_DDR_DQ26_502)
DDR_DQ27: U7.Y4(PS_DDR_DQ27_502)
DDR_DQ28: U7.Y2(PS_DDR_DQ28_502)
DDR_DQ29: U7.W3(PS_DDR_DQ29_502)
DDR_DQ30: U7.V2(PS_DDR_DQ30_502)
DDR_DQ31: U7.V3(PS_DDR_DQ31_502)
DDR_DQS0_N: U7.B2(PS_DDR_DQS_N0_502)
DDR_DQS0_P: U7.C2(PS_DDR_DQS_P0_502)
DDR_DQS1_N: U7.F2(PS_DDR_DQS_N1_502)
DDR_DQS1_P: U7.G2(PS_DDR_DQS_P1_502)
DDR_DQS2_N: U7.T2(PS_DDR_DQS_N2_502)
DDR_DQS2_P: U7.R2(PS_DDR_DQS_P2_502)
DDR_DQS3_N: U7.W4(PS_DDR_DQS_N3_502)
DDR_DQS3_P: U7.W5(PS_DDR_DQS_P3_502)
DDR_NCAS: R105.1 U7.P5(PS_DDR_CAS_B_502)
DDR_NCS: R103.1 U7.N1(PS_DDR_CS_B_502)
DDR_NRAS: R104.1 U7.P4(PS_DDR_RAS_B_502)
DDR_NRST: R125.1 U7.B4(PS_DDR_DRST_B_502)
DDR_NWE: R106.1 U7.M5(PS_DDR_WE_B_502)
DDR_ODT: R160.1 U7.N5(PS_DDR_ODT_502)
DDR_VRN: R126.2 U7.G5(PS_DDR_VRN_502)
DDR_VRP: R127.1 U7.H5(PS_DDR_VRP_502)

### Layout directives
net class DDR_ACC: DDR_A0, DDR_A1, DDR_A2, DDR_A3, DDR_A4, DDR_A5, DDR_A6, DDR_A7, DDR_A8, DDR_A9, DDR_A10, DDR_A11, DDR_A12, DDR_A13, DDR_A14, DDR_BA0, DDR_BA1, DDR_BA2, DDR_CK_N, DDR_CK_P, DDR_CKE, DDR_NCAS, DDR_NCS, DDR_NRAS, DDR_NRST, DDR_NWE, DDR_ODT
differential pair; differential pair class 100ohm: DDR_CK_N, DDR_CK_P, DDR_DQS0_N, DDR_DQS0_P, DDR_DQS1_N, DDR_DQS1_P, DDR_DQS2_N, DDR_DQS2_P, DDR_DQS3_N, DDR_DQS3_P

### Notes on the sheet
- Zynq DDR Interface & Termination
- ACC = address control command
- (near C113) 1% resistors
- Caps need to be placed close to termination resistors
- Fly-by routing: Zynq -> U14 -> U15-> VTT Resistors

### Library data of the parts
C113-C120 C125 C126 = CAP_0201: Capacitor SMD 0201; Rating: 16V; Manufacturer: *; Manufacturer Part Number: *; Distributor Link: *; LCSC: *; Dielectric: *
C121-C124 = CAP_0402: Capacitor SMD 0402; Manufacturer: *; Manufacturer Part Number: *; Distributor Link: *; LCSC: *; Rating: *; Dielectric: *
R101-R124 R160 = RES_0201: Resistor SMD 0201; Manufacturer: *; Manufacturer Part Number: *; Distributor Link: *; LCSC: *
R125-R127 = RES_0402: Resistor SMD 0402; Manufacturer: *; Manufacturer Part Number: *; Distributor Link: *; LCSC: *